# EAGLE design HV Board rev13 (EAGLE 9.6.2)
ENGINEER: Arvind Srinivasan

## Sheet 1 of 3: GLV Systems 1 (Main I/O, Power, Current Sensors, and Shutdown Circuit)
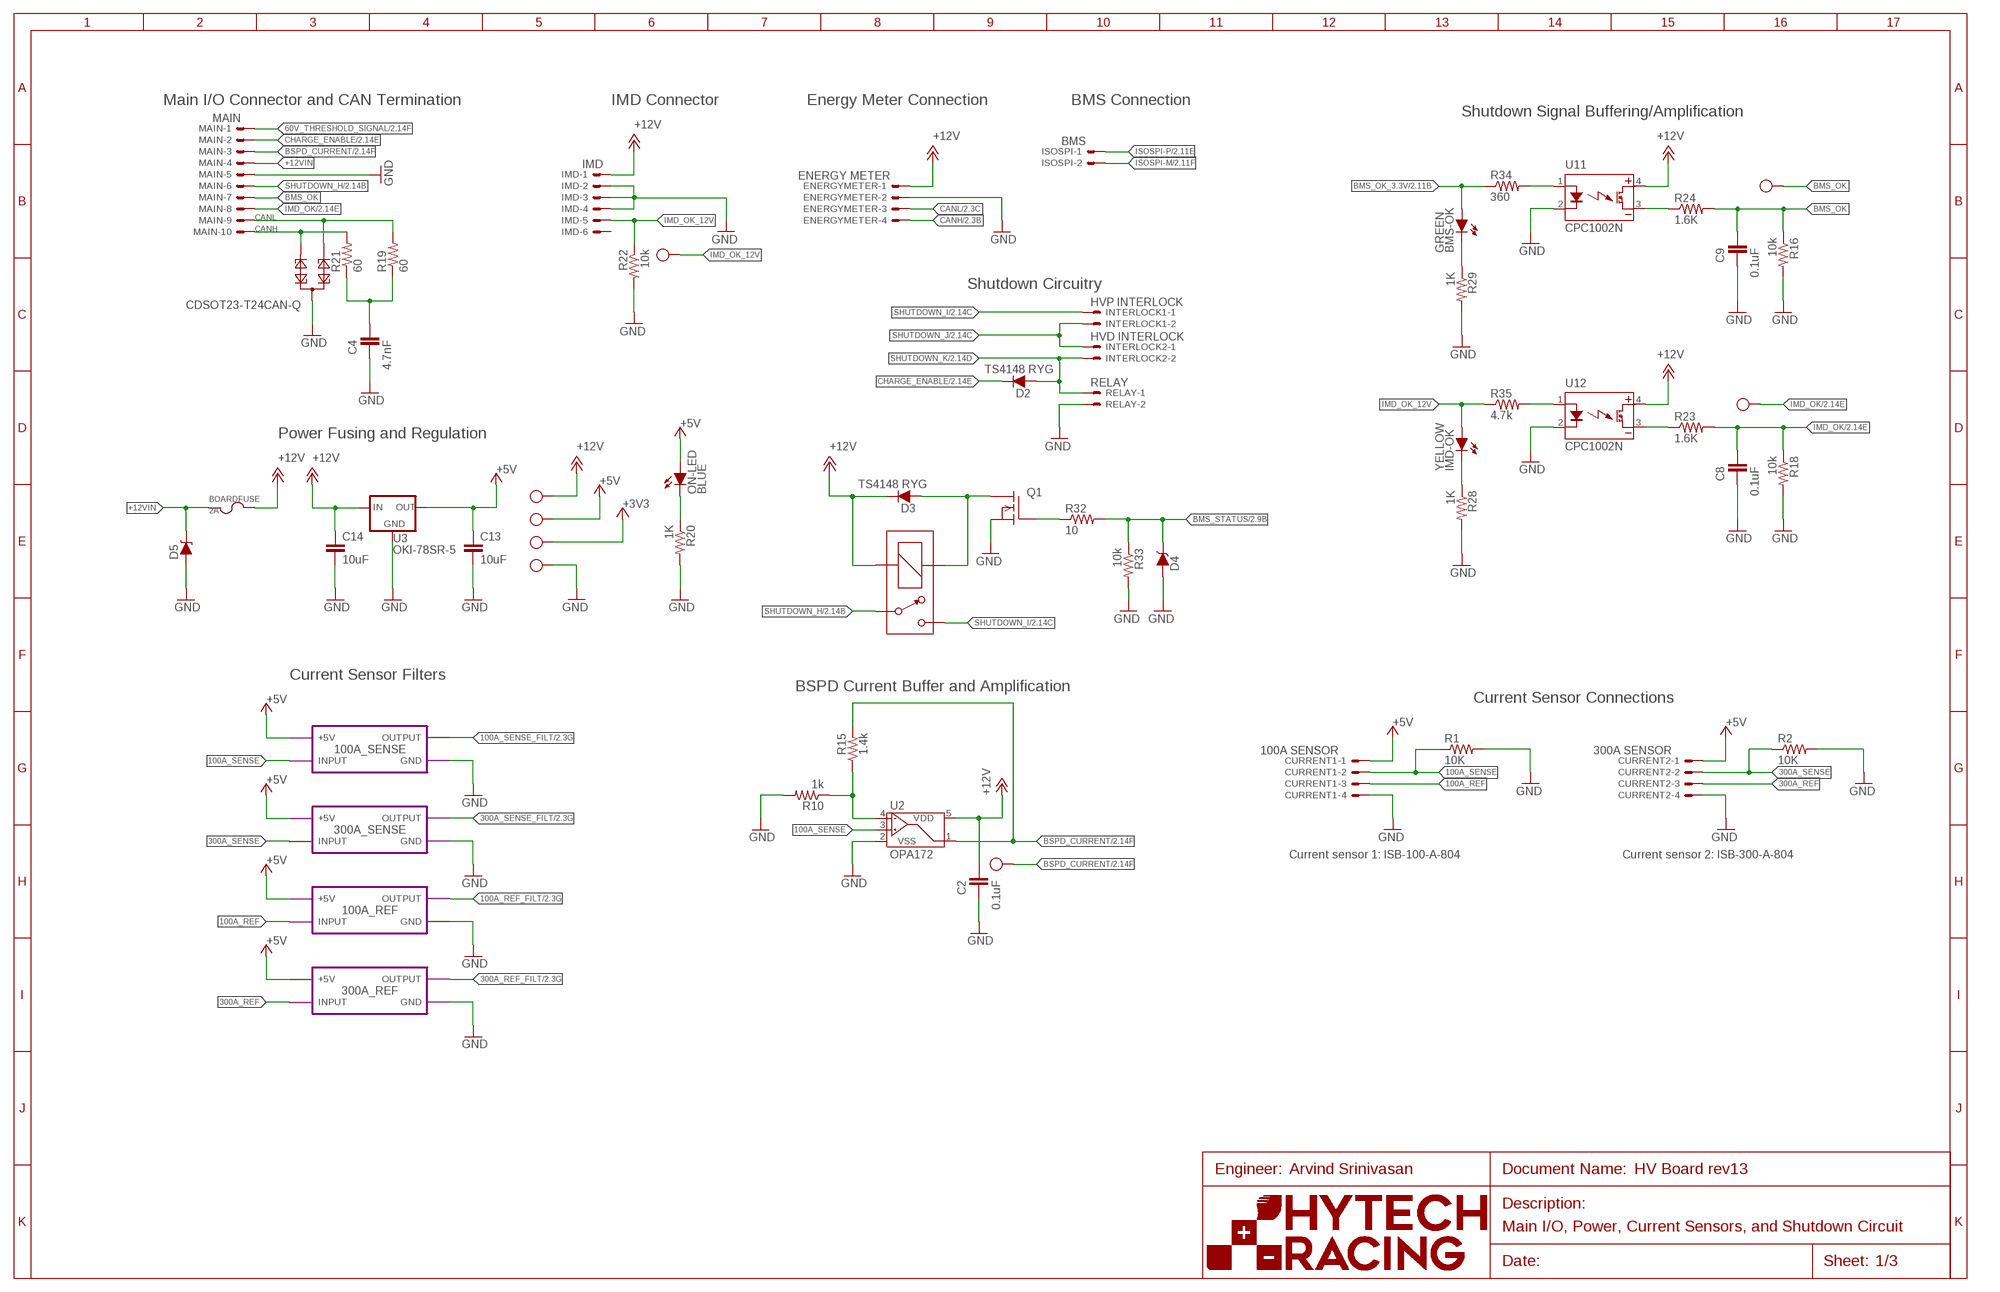
[diagram p0: schematic, sheet 1]
U$1 (FRAME_B): FRAME_DESCRIPTION: Main I/O, Power, Current Sensors, and Shutdown Circuit; ORIENTATION: LANDSCAPE; SIZE: B

### Parts
BMS-OK  GREEN  LED-0603  [LED-603]
BOARDFUSE  2A  FUSE_MINIBLADE  [MINI-BLADE_FUSE_HOLDER]
C2  0.1uF  CAP0603-CAP  [0603-CAP]
C4  4.7nF  CAP0603-CAP  [0603-CAP]
C8  0.1uF  CAP0603-CAP  [0603-CAP]
C9  0.1uF  CAP0603-CAP  [0603-CAP]
C13  10uF  CAP0603-CAP  [0603-CAP]
C14  10uF  CAP0603-CAP  [0603-CAP]
CURRENT1  100A SENSOR  CONNECTOR-4NANO-FIT-VERTICAL-4  [NANO-FIT_VERTICAL-4]
CURRENT2  300A SENSOR  CONNECTOR-4NANO-FIT-VERTICAL-4  [NANO-FIT_VERTICAL-4]
D2  TS4148 RYG  DIODE0805  [0805_D]
D3  TS4148 RYG  DIODE0805  [0805_D]
D4  MMBZ5246BLT1G  DIODE_ZENER  [SOT23]
D5  TVS_DIODE  [U-DFN1608-2]
ENERGYMETER  ENERGY METER  CONNECTOR-4NANO-FIT-VERTICAL-4  [NANO-FIT_VERTICAL-4]
IMD  IMD  CONNECTOR-6NANO-FIT_VERTICAL-6  [NANO-FIT_VERTICAL-6]
IMD-OK  YELLOW  LED-0603  [LED-603]
INTERLOCK1  HVP INTERLOCK  CONNECTOR-2NANO-FIT_VERTICAL-2  [NANO-FIT_VERTICAL-2]
INTERLOCK2  HVD INTERLOCK  CONNECTOR-2NANO-FIT_VERTICAL-2  [NANO-FIT_VERTICAL-2]
ISOSPI  BMS  CONNECTOR-2NANO-FIT_VERTICAL-2  [NANO-FIT_VERTICAL-2]
MAIN  MAIN  CONNECTOR-10NANO-FIT_VERTICAL-10  [NANO-FIT_VERTICAL-10]
ON-LED  BLUE  LED-0603  [LED-603]
Q1  DMG3406L  DMG3406LSOT  [SOT23]
R1  10K  RESISTOR0603  [0603-RES]
R2  10K  RESISTOR0603  [0603-RES]
R10  1k  RESISTOR0603  [0603-RES]
R15  1.4k  RESISTOR0603  [0603-RES]
R16  10k  RESISTOR0603  [0603-RES]
R18  10k  RESISTOR0603  [0603-RES]
R19  60  RESISTOR0603  [0603-RES]
R20  1K  RESISTOR0603  [0603-RES]
R21  60  RESISTOR0603  [0603-RES]
R22  10k  RESISTOR0603  [0603-RES]
R23  1.6K  RESISTOR0603  [0603-RES]
R24  1.6K  RESISTOR0603  [0603-RES]
R28  1K  RESISTOR0603  [0603-RES]
R29  1K  RESISTOR0603  [0603-RES]
R32  10  RESISTOR0603  [0603-RES]
R33  10k  RESISTOR0603  [0603-RES]
R34  360  RESISTOR0603  [0603-RES]
R35  4.7k  RESISTOR0603  [0603-RES]
RELAY  RELAY  CONNECTOR-2NANO-FIT_VERTICAL-2  [NANO-FIT_VERTICAL-2]
SOFTWARE_SHUTDOWN  SOFTWARE SHUTDOWN  G5LE-1A4  [G5LE-1A4]
U2  OPA172  OPA172SOT-323-5  [SOT323-5]
U3  OKI-78SR-5  [OKI-78SR]
U8  CDSOT23-T24CAN-Q  [SOT23]
U11  CPC1002N  [SOP04]
U12  CPC1002N  [SOP04]
U$3  TEST_POINTMICRO_MINIATURE  [MICRO_MINIATURE]
U$4  TEST_POINTMICRO_MINIATURE  [MICRO_MINIATURE]
U$5  TEST_POINTMICRO_MINIATURE  [MICRO_MINIATURE]
U$6  TEST_POINTMICRO_MINIATURE  [MICRO_MINIATURE]
U$7  TEST_POINTMICRO_MINIATURE  [MICRO_MINIATURE]
U$11  TEST_POINTMICRO_MINIATURE  [MICRO_MINIATURE]
U$13  TEST_POINTMICRO_MINIATURE  [MICRO_MINIATURE]
U$14  TEST_POINTMICRO_MINIATURE  [MICRO_MINIATURE]

### Module instances
100A_SENSE = 1KHZ-FILTER
300A_SENSE = 1KHZ-FILTER
100A_REF = 1KHZ-FILTER
300A_REF = 1KHZ-FILTER

### Nets
60V_THRESHOLD_SIGNAL: MAIN.P$1 ; also sheet 2,3
100A_REF: CURRENT1.P$3 ; port 100A_REF.INPUT
100A_REF_FILT: port 100A_REF.OUTPUT ; also sheet 2
100A_SENSE: CURRENT1.P$2 R1.1 U2.3(VIN+) ; port 100A_SENSE.INPUT
100A_SENSE_FILT: port 100A_SENSE.OUTPUT ; also sheet 2
300A_REF: CURRENT2.P$3 ; port 300A_REF.INPUT
300A_REF_FILT: port 300A_REF.OUTPUT ; also sheet 2
300A_SENSE: CURRENT2.P$2 R2.1 ; port 300A_SENSE.INPUT
300A_SENSE_FILT: port 300A_SENSE.OUTPUT ; also sheet 2
+3V3: U$7.P$1 ; also sheet 2
+5V: C13.1 CURRENT1.P$1 CURRENT2.P$1 ON-LED.A U3.3(OUT) U$4.P$1 ; port 100A_SENSE.+5V 300A_SENSE.+5V 100A_REF.+5V 300A_REF.+5V ; also sheet 2,3
+12V: BOARDFUSE.R1 BOARDFUSE.R2 C2.2 C14.1 D3.C ENERGYMETER.P$1 IMD.P$1 SOFTWARE_SHUTDOWN.2(COIL-) U2.5(VDD) U3.1(IN) U11.4(DC+) U12.4(DC+) U$5.P$1
+12VIN: BOARDFUSE.L1 BOARDFUSE.L2 D5.P$2(C) MAIN.P$4
BMS_OK: C9.2 MAIN.P$7 R16.1 R24.2 U$14.P$1
BMS_OK_3.3V: BMS-OK.A R34.1 ; also sheet 2
BMS_OK_PRE_FILTER: R24.1 U11.3(DC-)
BMS_STATUS: D4.3(C) R32.2 R33.1 ; also sheet 2
BSPD_CURRENT: MAIN.P$3 R15.2 U2.1(VOUT) U$6.P$1 ; also sheet 2
CANH: ENERGYMETER.P$4 MAIN.P$10 R21.2 U8.2 ; also sheet 2
CANL: ENERGYMETER.P$3 MAIN.P$9 R19.2 U8.1 ; also sheet 2
CHARGE_ENABLE: D2.C MAIN.P$2 ; also sheet 2
GND: C2.1 C4.1 C8.1 C9.1 C13.2 C14.2 CURRENT1.P$4 CURRENT2.P$4 D4.1(A) D5.P$1(A) ENERGYMETER.P$2 IMD.P$2 IMD.P$3 IMD.P$4 MAIN.P$5 Q1.2(S) R1.2 R2.2 R10.2 R16.2 R18.2 R20.2 R22.2 R28.2 R29.2 R33.2 RELAY.P$2 U2.2(VSS) U3.2(GND) U8.3 U11.2(CONTROL-) U12.2(CONTROL-) U$3.P$1 ; port 100A_SENSE.GND 300A_SENSE.GND 100A_REF.GND 300A_REF.GND ; also sheet 2,3
IMD_OK: C8.2 MAIN.P$8 R18.1 R23.2 U$13.P$1 ; also sheet 2
IMD_OK_12V: IMD-OK.A IMD.P$5 R22.1 R35.1 U$11.P$1
IMD_OK_PRE_FILTER: R23.1 U12.3(DC-)
ISOSPI-M [ISO_SPI]: ISOSPI.P$2 ; also sheet 2
ISOSPI-P [ISO_SPI]: ISOSPI.P$1 ; also sheet 2
N$1: D3.A Q1.3(D) SOFTWARE_SHUTDOWN.1(COIL+)
N$3: ON-LED.C R20.1
N$7: R10.1 R15.1 U2.4(VIN-)
N$8: R35.2 U12.1(CONTROL+)
N$9: IMD-OK.C R28.1
N$11: C4.2 R19.1 R21.1
N$12: Q1.1(G) R32.1
N$16: R34.2 U11.1(CONTROL+)
N$17: BMS-OK.C R29.1
SHUTDOWN_H: MAIN.P$6 SOFTWARE_SHUTDOWN.P ; also sheet 2
SHUTDOWN_I: INTERLOCK1.P$1 SOFTWARE_SHUTDOWN.S ; also sheet 2
SHUTDOWN_J: INTERLOCK1.P$2 INTERLOCK2.P$1 ; also sheet 2
SHUTDOWN_K: D2.A INTERLOCK2.P$2 RELAY.P$1 ; also sheet 2,3
Unconnected: IMD.P$6

### Notes on the sheet
- Main I/O Connector and CAN Termination | IMD Connector | Energy Meter Connection | BMS Connection
- Shutdown Signal Buffering/Amplification
- Shutdown Circuitry
- Power Fusing and Regulation
- Current Sensor Filters
- BSPD Current Buffer and Amplification
- Current Sensor Connections
- Current sensor 1: ISB-100-A-804 | Current sensor 2: ISB-300-A-804

## Sheet 2 of 3: GLV Systems 2 (Microcontroller, Watchdog, BMS, CAN, and ADC)
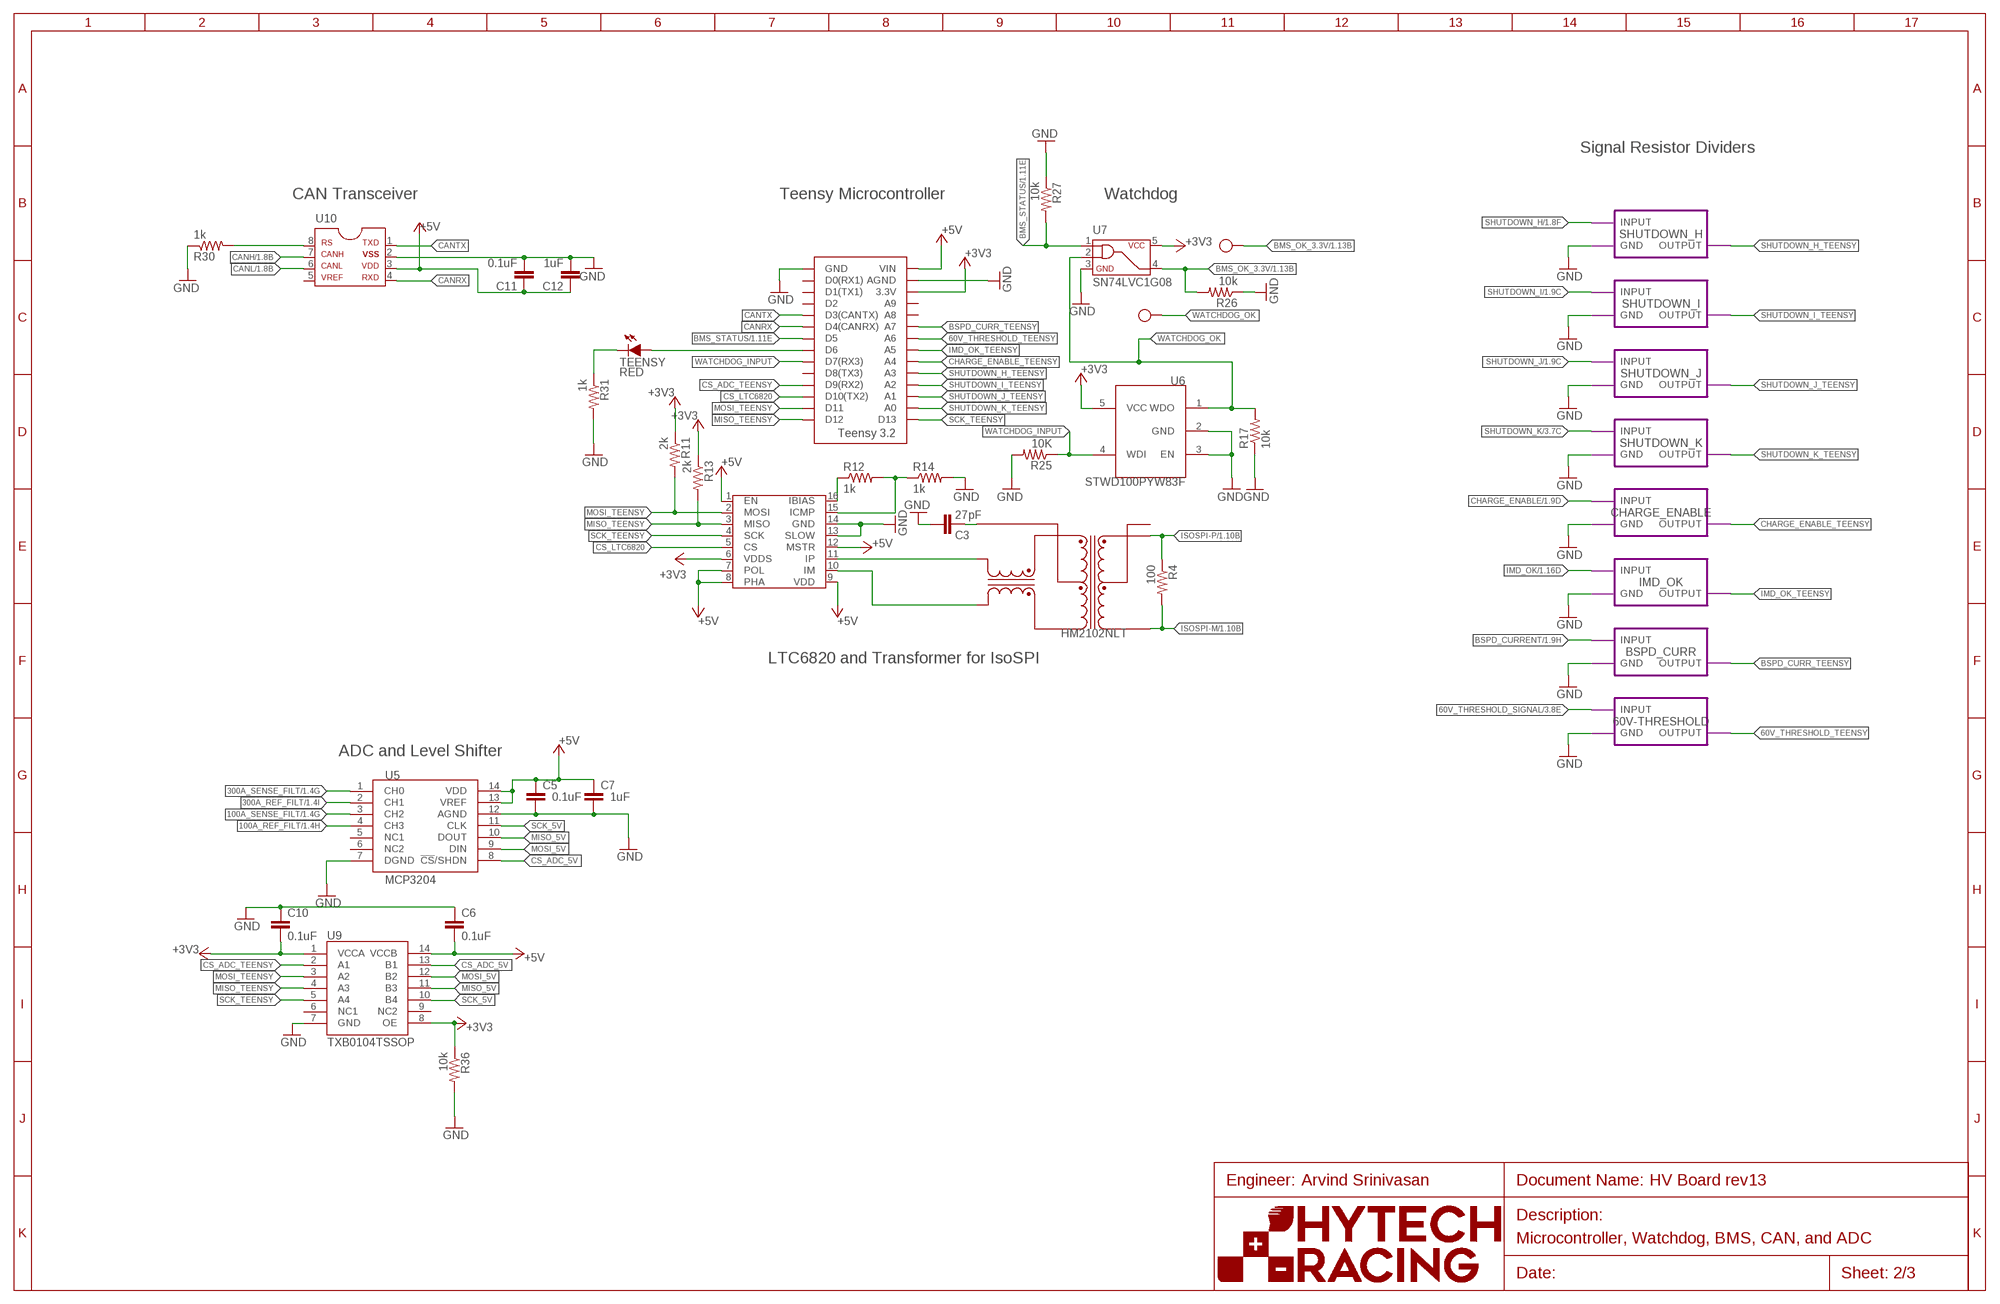
[diagram p1: schematic, sheet 2]
U$12 (FRAME_B): FRAME_DESCRIPTION: Microcontroller, Watchdog, BMS, CAN, and ADC; ORIENTATION: LANDSCAPE; SIZE: B

### Parts
C3  27pF  CAP0603-CAP  [0603-CAP]
C5  0.1uF  CAP0603-CAP  [0603-CAP]
C6  0.1uF  CAP0603-CAP  [0603-CAP]
C7  1uF  CAP0603-CAP  [0603-CAP]
C10  0.1uF  CAP0603-CAP  [0603-CAP]
C11  0.1uF  CAP0603-CAP  [0603-CAP]
C12  1uF  CAP0603-CAP  [0603-CAP]
R4  100  RESISTOR0603  [0603-RES]
R11  2k  RESISTOR0603  [0603-RES]
R12  1k  RESISTOR0603  [0603-RES]
R13  2k  RESISTOR0603  [0603-RES]
R14  1k  RESISTOR0603  [0603-RES]
R17  10k  RESISTOR0603  [0603-RES]
R25  10K  RESISTOR0603  [0603-RES]
R26  10k  RESISTOR0603  [0603-RES]
R27  10k  RESISTOR0603  [0603-RES]
R30  1k  RESISTOR0603  [0603-RES]
R31  1k  RESISTOR0603  [0603-RES]
R36  10k  RESISTOR0603  [0603-RES]
TEENSY  RED  LED-0603  [LED-603]
TEENSY3.1  TEENSY_3.2_SIMPLE  [TEENSY_3.2_SIMPLE]
U1  HM2102NLT  [HM2102NLT]
U4  LTC6820  [MSOP-16]
U5  MCP3204  [SO14]
U6  STWD100PYW83F  [SOT323-5]
U7  SN74LVC1G08  SN74LVC1G08SOT-323-5  [SOT323-5]
U9  TXB0104TSSOP  [TSSOP-14]
U10  MCP2551  [SOIC-08]
U$9  TEST_POINTMICRO_MINIATURE  [MICRO_MINIATURE]
U$10  TEST_POINTMICRO_MINIATURE  [MICRO_MINIATURE]

### Module instances
SHUTDOWN_K = 43/12-RESISTOR-DIVIDER
SHUTDOWN_I = 43/12-RESISTOR-DIVIDER
SHUTDOWN_H = 43/12-RESISTOR-DIVIDER
IMD_OK = 43/12-RESISTOR-DIVIDER
BSPD_CURR = 43/12-RESISTOR-DIVIDER
CHARGE_ENABLE = 43/12-RESISTOR-DIVIDER
60V-THRESHOLD = 10/10-RESISTOR-DIVIDER
SHUTDOWN_J = 43/12-RESISTOR-DIVIDER

### Nets
60V_THRESHOLD_SIGNAL: port 60V-THRESHOLD.INPUT ; also sheet 1,3
60V_THRESHOLD_TEENSY: TEENSY3.1.A6 ; port 60V-THRESHOLD.OUTPUT
100A_REF_FILT: U5.4(CH3) ; also sheet 1
100A_SENSE_FILT: U5.3(CH2) ; also sheet 1
300A_REF_FILT: U5.2(CH1) ; also sheet 1
300A_SENSE_FILT: U5.1(CH0) ; also sheet 1
+3V3: C10.1 R11.1 R13.1 R36.1 TEENSY3.1.3.3V U4.6(VDDS) U6.5(VCC) U7.5 U9.1(VCCA) U9.8(OE) ; also sheet 1
+5V: C5.1 C6.1 C7.1 C11.2 C12.2 TEENSY3.1.VIN U4.1(EN) U4.7(POL) U4.8(PHA) U4.9(VDD) U4.12(MSTR) U5.13(VREF) U5.14(VDD) U9.14(VCCB) U10.3 ; also sheet 1,3
BMS_OK_3.3V: R26.2 U7.4 U$10.P$1 ; also sheet 1
BMS_STATUS: R27.2 TEENSY3.1.D5 U7.1 ; also sheet 1
BSPD_CURR_TEENSY: TEENSY3.1.A7 ; port BSPD_CURR.OUTPUT
BSPD_CURRENT: port BSPD_CURR.INPUT ; also sheet 1
CANH: U10.7 ; also sheet 1
CANL: U10.6 ; also sheet 1
CANRX: TEENSY3.1.D4(CANRX) U10.4
CANTX: TEENSY3.1.D3(CANTX) U10.1
CHARGE_ENABLE: port CHARGE_ENABLE.INPUT ; also sheet 1
CHARGE_ENABLE_TEENSY: TEENSY3.1.A4 ; port CHARGE_ENABLE.OUTPUT
CS_ADC_5V: U5.8(!CS!/SHDN) U9.13(B1)
CS_ADC_TEENSY: TEENSY3.1.D9(RX2) U9.2(A1)
CS_LTC6820: TEENSY3.1.D10(TX2) U4.5(CS)
GND: C3.2 C5.2 C6.2 C7.2 C10.2 C11.1 C12.1 R14.2 R17.1 R25.2 R26.1 R27.1 R30.1 R31.2 R36.2 TEENSY3.1.AGND TEENSY3.1.GND U4.13(SLOW) U4.14(GND) U5.7(DGND) U5.12(AGND) U6.2(GND) U6.3(EN) U7.3 U9.7(GND) U10.2 ; port SHUTDOWN_H.GND SHUTDOWN_I.GND SHUTDOWN_K.GND CHARGE_ENABLE.GND IMD_OK.GND BSPD_CURR.GND 60V-THRESHOLD.GND SHUTDOWN_J.GND ; also sheet 1,3
IM: U1.P$10(TD-) U4.10(IM)
IMD_OK: port IMD_OK.INPUT ; also sheet 1
IMD_OK_TEENSY: TEENSY3.1.A5 ; port IMD_OK.OUTPUT
IP: U1.P$12(TD+) U4.11(IP)
ISOSPI-M [ISO_SPI]: R4.2 U1.P$3(MX-) ; also sheet 1
ISOSPI-P [ISO_SPI]: R4.1 U1.P$1(MX+) ; also sheet 1
MISO_5V: U5.10(DOUT) U9.11(B3)
MISO_TEENSY: R13.2 TEENSY3.1.D12 U4.3(MISO) U9.4(A3)
MOSI_5V: U5.9(DIN) U9.12(B2)
MOSI_TEENSY: R11.2 TEENSY3.1.D11 U4.2(MOSI) U9.3(A2)
N$26: R30.2 U10.8
N$29: R31.1 TEENSY.C
N$31: R12.1 U4.16(IBIAS)
N$32: R12.2 R14.1 U4.15(ICMP)
N$35: C3.1 U1.P$11(TCT)
SCK_5V: U5.11(CLK) U9.10(B4)
SCK_TEENSY: TEENSY3.1.D13 U4.4(SCK) U9.5(A4)
SHUTDOWN_H: port SHUTDOWN_H.INPUT ; also sheet 1
SHUTDOWN_H_TEENSY: TEENSY3.1.A3 ; port SHUTDOWN_H.OUTPUT
SHUTDOWN_I: port SHUTDOWN_I.INPUT ; also sheet 1
SHUTDOWN_I_TEENSY: TEENSY3.1.A2 ; port SHUTDOWN_I.OUTPUT
SHUTDOWN_J: port SHUTDOWN_J.INPUT ; also sheet 1
SHUTDOWN_J_TEENSY: TEENSY3.1.A1 ; port SHUTDOWN_J.OUTPUT
SHUTDOWN_K: port SHUTDOWN_K.INPUT ; also sheet 1,3
SHUTDOWN_K_TEENSY: TEENSY3.1.A0 ; port SHUTDOWN_K.OUTPUT
TEENSY_STATUS: TEENSY3.1.D6 TEENSY.A
WATCHDOG_INPUT: R25.1 TEENSY3.1.D7(RX3) U6.4(WDI)
WATCHDOG_OK: R17.2 U6.1(WDO) U7.2 U$9.P$1
Unconnected: TEENSY3.1.A8 TEENSY3.1.A9 TEENSY3.1.D0(RX1) TEENSY3.1.D1(TX1) TEENSY3.1.D2 TEENSY3.1.D8(TX3) U1.P$2(MCT) U1.P$4(MX+) U1.P$5(MCT) U1.P$6(MX-) U1.P$7(TD-) U1.P$8(TCT) U1.P$9(TD+) U5.5(NC1) U5.6(NC2) U9.6(NC1) U9.9(NC2) U10.5

### Notes on the sheet
- Signal Resistor Dividers
- CAN Transceiver | Teensy Microcontroller | Watchdog
- LTC6820 and Transformer for IsoSPI
- ADC and Level Shifter

## Sheet 3 of 3: HV Systems (Discharge, Precharge, and TSAL Signal/Voltage Indicator)
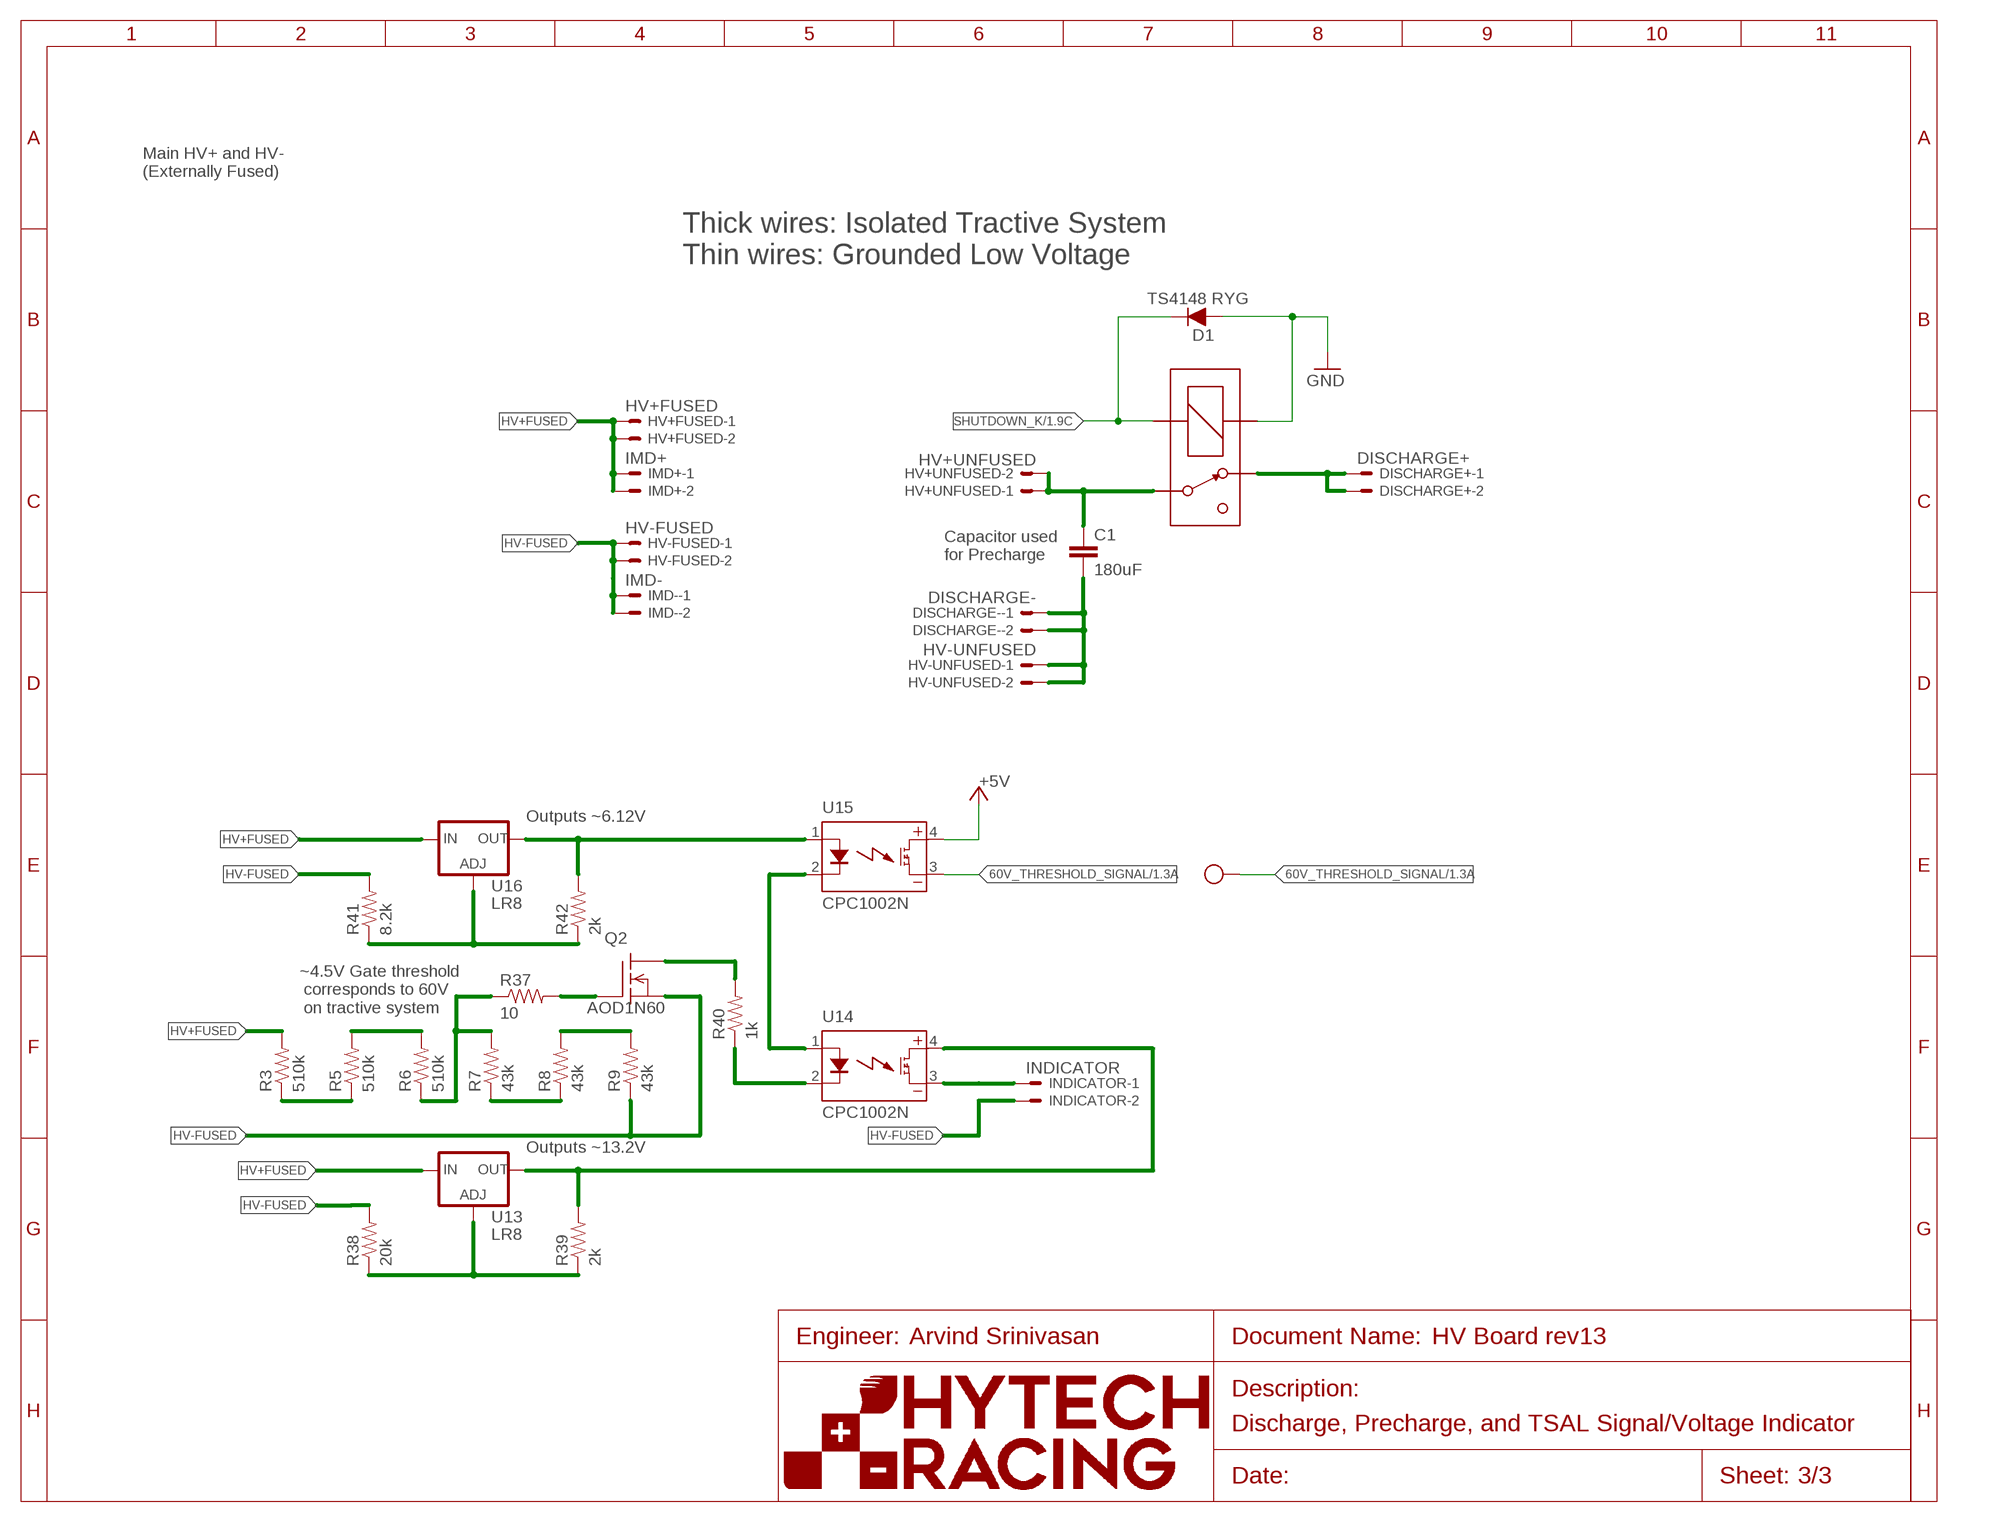
[diagram p2: schematic, sheet 3]
U$2 (FRAME_A): FRAME_DESCRIPTION: Discharge, Precharge, and TSAL Signal/Voltage Indicator; ORIENTATION: LANDSCAPE; SIZE: A

### Parts
$$U$12  DBT71210  [DBT71210]
C1  180uF  CAP  [LLS2V181MELA]
D1  TS4148 RYG  DIODE0805  [0805_D]
DISCHARGE+  DISCHARGE+  CONNECTOR-2NANO-FIT_VERTICAL-2  [NANO-FIT_VERTICAL-2]
DISCHARGE-  DISCHARGE-  CONNECTOR-2NANO-FIT_VERTICAL-2  [NANO-FIT_VERTICAL-2]
HV+FUSED  HV+FUSED  CONNECTOR-2NANO-FIT_VERTICAL-2  [NANO-FIT_VERTICAL-2]
HV+UNFUSED  HV+UNFUSED  CONNECTOR-2NANO-FIT_VERTICAL-2  [NANO-FIT_VERTICAL-2]
HV-FUSED  HV-FUSED  CONNECTOR-2NANO-FIT_VERTICAL-2  [NANO-FIT_VERTICAL-2]
HV-UNFUSED  HV-UNFUSED  CONNECTOR-2NANO-FIT_VERTICAL-2  [NANO-FIT_VERTICAL-2]
IMD+  IMD+  CONNECTOR-2NANO-FIT_VERTICAL-2  [NANO-FIT_VERTICAL-2]
IMD-  IMD-  CONNECTOR-2NANO-FIT_VERTICAL-2  [NANO-FIT_VERTICAL-2]
INDICATOR  INDICATOR  CONNECTOR-2NANO-FIT_VERTICAL-2  [NANO-FIT_VERTICAL-2]
Q2  AOD1N60  N-CHANNEL_MOSFETAOD1N60  [TO-252]
R3  510k  RESISTOR0603  [0603-RES]
R5  510k  RESISTOR0603  [0603-RES]
R6  510k  RESISTOR0603  [0603-RES]
R7  43k  RESISTOR0603  [0603-RES]
R8  43k  RESISTOR0603  [0603-RES]
R9  43k  RESISTOR0603  [0603-RES]
R37  10  RESISTOR0603  [0603-RES]
R38  20k  RESISTOR0603  [0603-RES]
R39  2k  RESISTOR0603  [0603-RES]
R40  1k  RESISTOR0603  [0603-RES]
R41  8.2k  RESISTOR0603  [0603-RES]
R42  2k  RESISTOR0603  [0603-RES]
U13  LR8  [SOT89]
U14  CPC1002N  [SOP04]
U15  CPC1002N  [SOP04]
U16  LR8  [SOT89]
U$8  TEST_POINTMICRO_MINIATURE  [MICRO_MINIATURE]

### Nets
60V_THRESHOLD_SIGNAL: U15.3(DC-) U$8.P$1 ; also sheet 1,2
+5V: U15.4(DC+) ; also sheet 1,2
DISCHARGE+ [TS]: $$U$12.CONTACT2(O) DISCHARGE+.P$1 DISCHARGE+.P$2
GND: $$U$12.COIL+ D1.A ; also sheet 1,2
HV+FUSED [TS]: HV+FUSED.P$1 HV+FUSED.P$2 IMD+.P$1 IMD+.P$2 R3.2 U13.1(IN) U16.1(IN)
HV+UNFUSED [TS]: $$U$12.CONTACT1(P) C1.P$1 HV+UNFUSED.P$1 HV+UNFUSED.P$2
HV-FUSED [TS]: HV-FUSED.P$1 HV-FUSED.P$2 IMD-.P$1 IMD-.P$2 INDICATOR.P$2 Q2.3(S) R9.1 R38.2 R41.2
HV-UNFUSED: C1.P$2 DISCHARGE-.P$1 DISCHARGE-.P$2 HV-UNFUSED.P$1 HV-UNFUSED.P$2
N$4: Q2.1(G) R37.2
N$5 [TS]: R39.2 U13.2(OUT) U13.PAD(OUT) U14.4(DC+)
N$6 [TS]: R38.1 R39.1 U13.3(ADJ)
N$18 [TS]: R42.2 U15.1(CONTROL+) U16.2(OUT) U16.PAD(OUT)
N$19 [TS]: R3.1 R5.1
N$24 [TS]: R5.2 R6.2
N$27 [TS]: R7.1 R8.1
N$28 [TS]: R8.2 R9.2
N$30 [TS]: R40.1 U14.2(CONTROL-)
N$33 [TS]: U14.1(CONTROL+) U15.2(CONTROL-)
N$34 [TS]: INDICATOR.P$1 U14.3(DC-)
N$41 [TS]: R41.1 R42.1 U16.3(ADJ)
N$55 [TS]: R6.1 R7.2 R37.1
N$58 [TS]: Q2.2(TAB)(D) R40.2
SHUTDOWN_K: $$U$12.COIL- D1.C ; also sheet 1,2

### Notes on the sheet
- Main HV+ and HV-
  (Externally Fused)
- Thick wires: Isolated Tractive System
  Thin wires: Grounded Low Voltage
- Capacitor used
  for Precharge
- Outputs ~6.12V
- ~4.5V Gate threshold
   corresponds to 60V
   on tractive system
- Outputs ~13.2V

## Library data of the parts
$$U$12 = HyTechDevices:DBT71210: DBT71210 Reed Relay Form B (Standard normally closed), switch 12V
BMS-OK IMD-OK ON-LED TEENSY = HyTechDevices:LED: Light Emitting Diode (LED) Source: Dangerous Prototypes Eagle Library <https://github.com/DangerousPrototypes/Eagle_Part_Library>
BOARDFUSE = HyTechDevices:FUSE: Fuse/Fuseclips Keystone Electronics 3568 Fuse Mouser Part <http://www.mouser.com/ProductDetail/Keystone-Electronics/3568> Datasheet <http://www.mouser.com/ds/2/215/568-742601.pdf> Bussman/Eaton Midget Fuse Clip 1A3400 <http://www.mouser.com/ProductDetail/Bussmann-Eaton/BK-1A3400-09-R/?qs=sGAEpiMZZMuG%252bgnN5hGYGzzlAelq2OxnKqVSMVjq8I4%3d> Schurter 0751.0110 Brass Fuse Clip Datasheet <http://www.mouser.com/ds/2/358/typ_OG__Clip__5x20-2553.pdf> Bel Fuse 0ZCF Series Surface Mount PTC (resettable) Fuse Datasheet <https://belfuse.com/resources/CircuitProtection/datasheets/0ZCF%20Nov2016.pdf> Littelfuse 1812L Series Surface Mount PTC (resettable) Fuse Datasheet <https://m.littelfuse.com/~/media/electronics/datasheets/resettable_ptcs/littelfuse_ptc_1812l_datasheet.pdf.pdf>; RATING: 3A
C1 = HyTechDevices:CAP: Capacitor Standard 0603 ceramic capacitor, and 0.1" leaded capacitor.
C2 C4 C8 C9 = HyTechDevices:CAP: Capacitor Standard 0603 ceramic capacitor, and 0.1" leaded capacitor.; TOLERANCE: 5%; VOLTAGE: 50V
C3 C5-C7 C10-C12 = HyTechDevices:CAP: Capacitor Standard 0603 ceramic capacitor, and 0.1" leaded capacitor.; TOLERANCE: 5%; VOLTAGE: 10V
C13 C14 = HyTechDevices:CAP: Capacitor Standard 0603 ceramic capacitor, and 0.1" leaded capacitor.; TOLERANCE: 5%; VOLTAGE: 25V
CURRENT1 CURRENT2 ENERGYMETER = HyTechDevices:CONNECTOR-4: Mini-Fit Junior connector 4 pole Source: http://www.molex.com
D1-D3 = HyTechDevices:DIODE: DIODE general purpose rectifier
D4 = HyTechDevices:DIODE_ZENER: ZENER DIODE
D5 = HyTechDevices:TVS_DIODE
DISCHARGE+ DISCHARGE- HV+FUSED HV+UNFUSED HV-FUSED HV-UNFUSED IMD+ IMD- INDICATOR INTERLOCK1 INTERLOCK2 ISOSPI RELAY = HyTechDevices:CONNECTOR-2: Mini-Fit Junior connector 2 pole Source: http://www.molex.com
IMD = HyTechDevices:CONNECTOR-6: Mini-Fit Junior connector 6 pole Source: http://www.molex.com
MAIN = HyTechDevices:CONNECTOR-10: Mini-Fit Junior connector 10 pole Source: http://www.molex.com
Q1 = HyTechDevices:DMG3406L: Generic NPN MOSFET DMG3406L (SOT-23, 2.8 A 30V)
Q2 = HyTechDevices:N-CHANNEL_MOSFET: Generic N-Channel MOSFET
R1 R2 R10-R16 R18-R25 R28-R31 R34-R36 = HyTechDevices:RESISTOR: Resistor Basic schematic elements and footprints for 0603, 1206, and PTH resistors.; TOLERANCE: 1%
R3 R5-R9 R17 R26 R27 R32 R33 R37-R42 = HyTechDevices:RESISTOR: Resistor Basic schematic elements and footprints for 0603, 1206, and PTH resistors.
R4 = HyTechDevices:RESISTOR: Resistor Basic schematic elements and footprints for 0603, 1206, and PTH resistors.; TOLERANCE: 1%; TYPE: TERMINATION
SOFTWARE_SHUTDOWN = HyTechDevices:G5LE-1A4: Omron G5LE SPST Relay DC12 (12VDC) model used Coil voltage: 75% - 170% of nominal voltage Datasheet <https://www.omron.com/ecb/products/pdf/en-g5le.pdf>
TEENSY3.1 = HyTechDevices:TEENSY_3.2_SIMPLE: Simple version of the Teensy 3.2 board that only uses the 2 main rows of pins, not the inner pins or the pins opposite the usb port.
U1 = HyTechDevices:HM2102NLT: 2 Channel SMT Transformer Turns ratio: 1CT: 1CT Isolation Voltage: 4300 VDC Inductance: 150 uH Leakage Inductance: 0.50 uH max DataSheet <https://www.mouser.com/datasheet/2/336/HM2102NL-1218600.pdf>
U2 = HyTechDevices:OPA172: TI OPA172 36V Op-Amp Datasheet <https://www.ti.com/lit/ds/symlink/opa172.pdf>
U3 = HyTechDevices:OKI-78SR-5: Murata OKI-78SR 5V 1.5A Non-Isolated Switching Regulator DC/DC - Datasheet <https://power.murata.com/data/power/oki-78sr.pdf>
U4 = HyTechDevices:LTC6820: Linear Technology isoSPI Isolated Communications Interface Datasheet <http://cds.linear.com/docs/en/datasheet/6820fb.pdf>
U5 = HyTechDevices:MCP3204
U6 = HyTechDevices:STWD100PYW83F: STWD100 Watchdog Timer (push-pull configuration) Datasheet <https://www.st.com/resource/en/datasheet/stwd100.pdf>
U7 = HyTechDevices:SN74LVC1G08: TI SN74LVC1G08 SINGLE 2-INPUT POSITIVE-AND GATE Datasheet <https://www.ti.com/lit/ds/symlink/sn74lvc1g08.pdf>
U8 = HyTechDevices:CDSOT23-T24CAN-Q: CAN Bus dual TVS array for transceiver ESD and surge protection
U9 = HyTechDevices:TXB0104: Texas Instruments TXB0104 4-channel low voltage to high voltage Logic Level Shifter. Minimum input voltage level 1.8V. Maximum output voltage level 5.5V.
U10 = HyTechDevices:MCP2551: MCP2551 High-Speed CAN Transceiver Product Webpage <https://www.microchip.com/wwwproducts/en/MCP2551> Datasheet <http://ww1.microchip.com/downloads/en/DeviceDoc/21667f.pdf> This device is outdated It is replaced by MCP2561. Comparison Page <https://www.microchip.com/wwwproducts/ProductCompare/MCP2551/MCP2561> Product Webpage <https://www.microchip.com/wwwproducts/en/MCP2561> Datasheet <http://ww1.microchip.com/downloads/en/DeviceDoc/20005167C.pdf>
U11 U12 U14 U15 = HyTechDevices:CPC1002N: IXYS Solid State Relay .7A
U13 U16 = HyTechDevices:LR8
U$3-U$11 U$13 U$14 = HyTechDevices:TEST_POINT: Keystone Electronics Test Point 5005

## Module 43/12-RESISTOR-DIVIDER
Ports: INPUT(in) GND(pwr) OUTPUT(out)
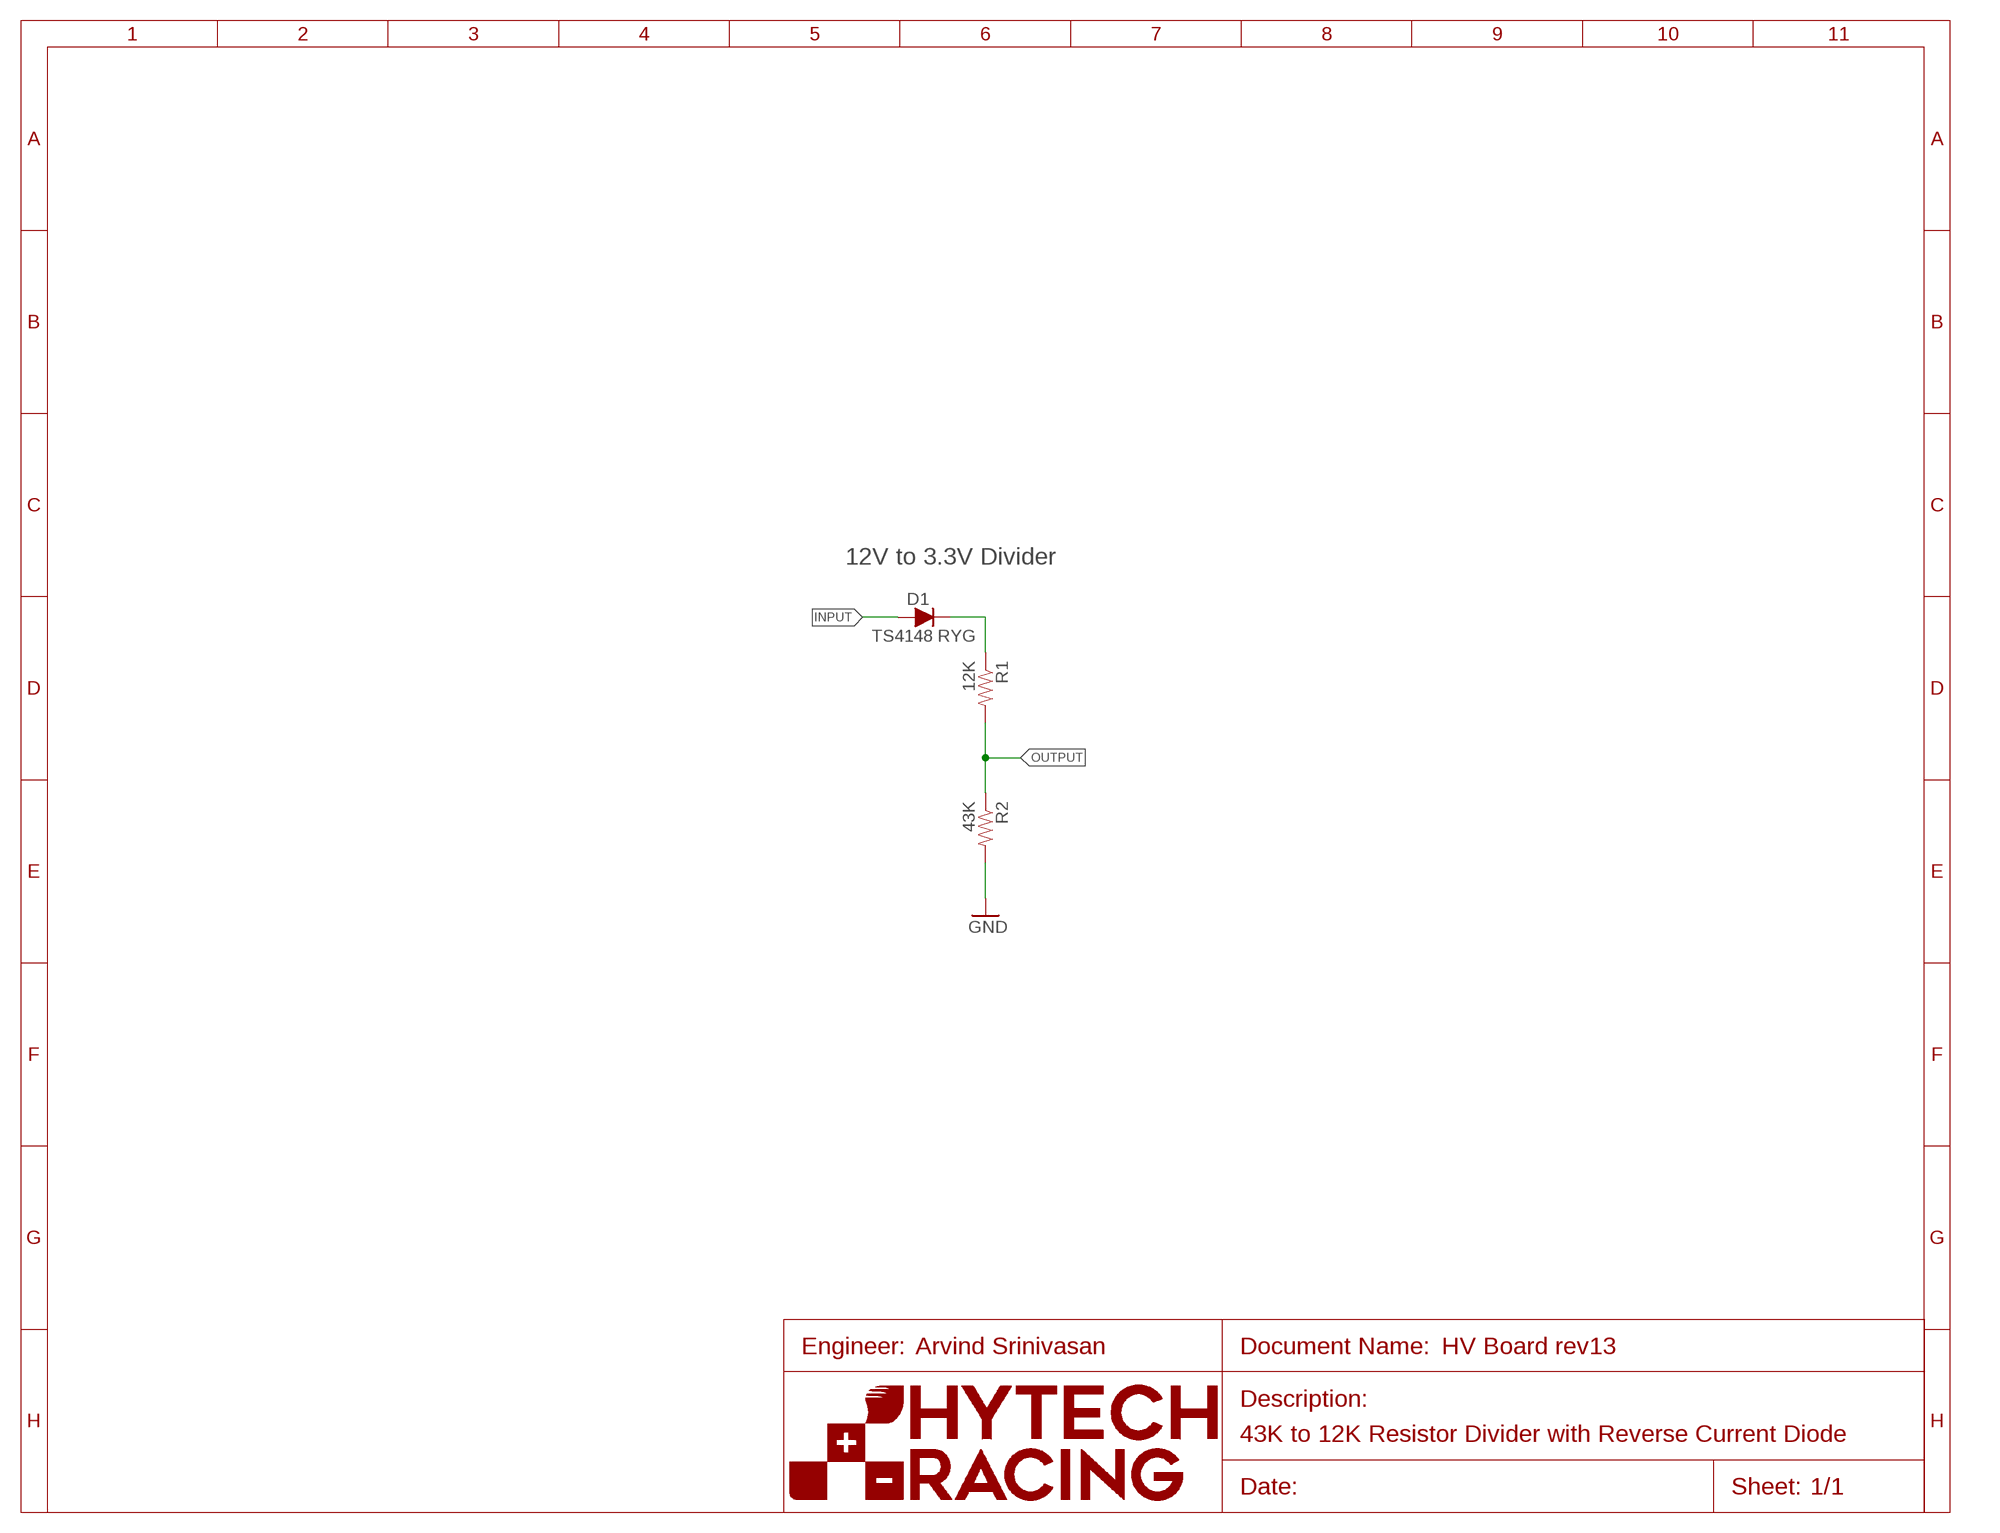
[diagram p3: schematic, module 43/12-RESISTOR-DIVIDER, sheet 1]
U$1 (FRAME_A): FRAME_DESCRIPTION: Default; ORIENTATION: LANDSCAPE; SIZE: A

### Parts
D1  TS4148 RYG  DIODE0805  [0805_D]
R1  12K  RESISTOR0603  [0603-RES]
R2  43K  RESISTOR0603  [0603-RES]

### Nets
GND: R2.2
INPUT: D1.A
INPUT_POST_DIODE: D1.C R1.1
OUTPUT: R1.2 R2.1

### Notes on the sheet
- 12V to 3.3V Divider
- Arvind Srinivasan
- 43K to 12K Resistor Divider with Reverse Current Diode

### Library data of the parts
D1 = HyTechDevices:DIODE: DIODE general purpose rectifier
R1 R2 = HyTechDevices:RESISTOR: Resistor Basic schematic elements and footprints for 0603, 1206, and PTH resistors.; TOLERANCE: 1%

## Module 10/10-RESISTOR-DIVIDER
Ports: INPUT(in) GND(pwr) OUTPUT(out)
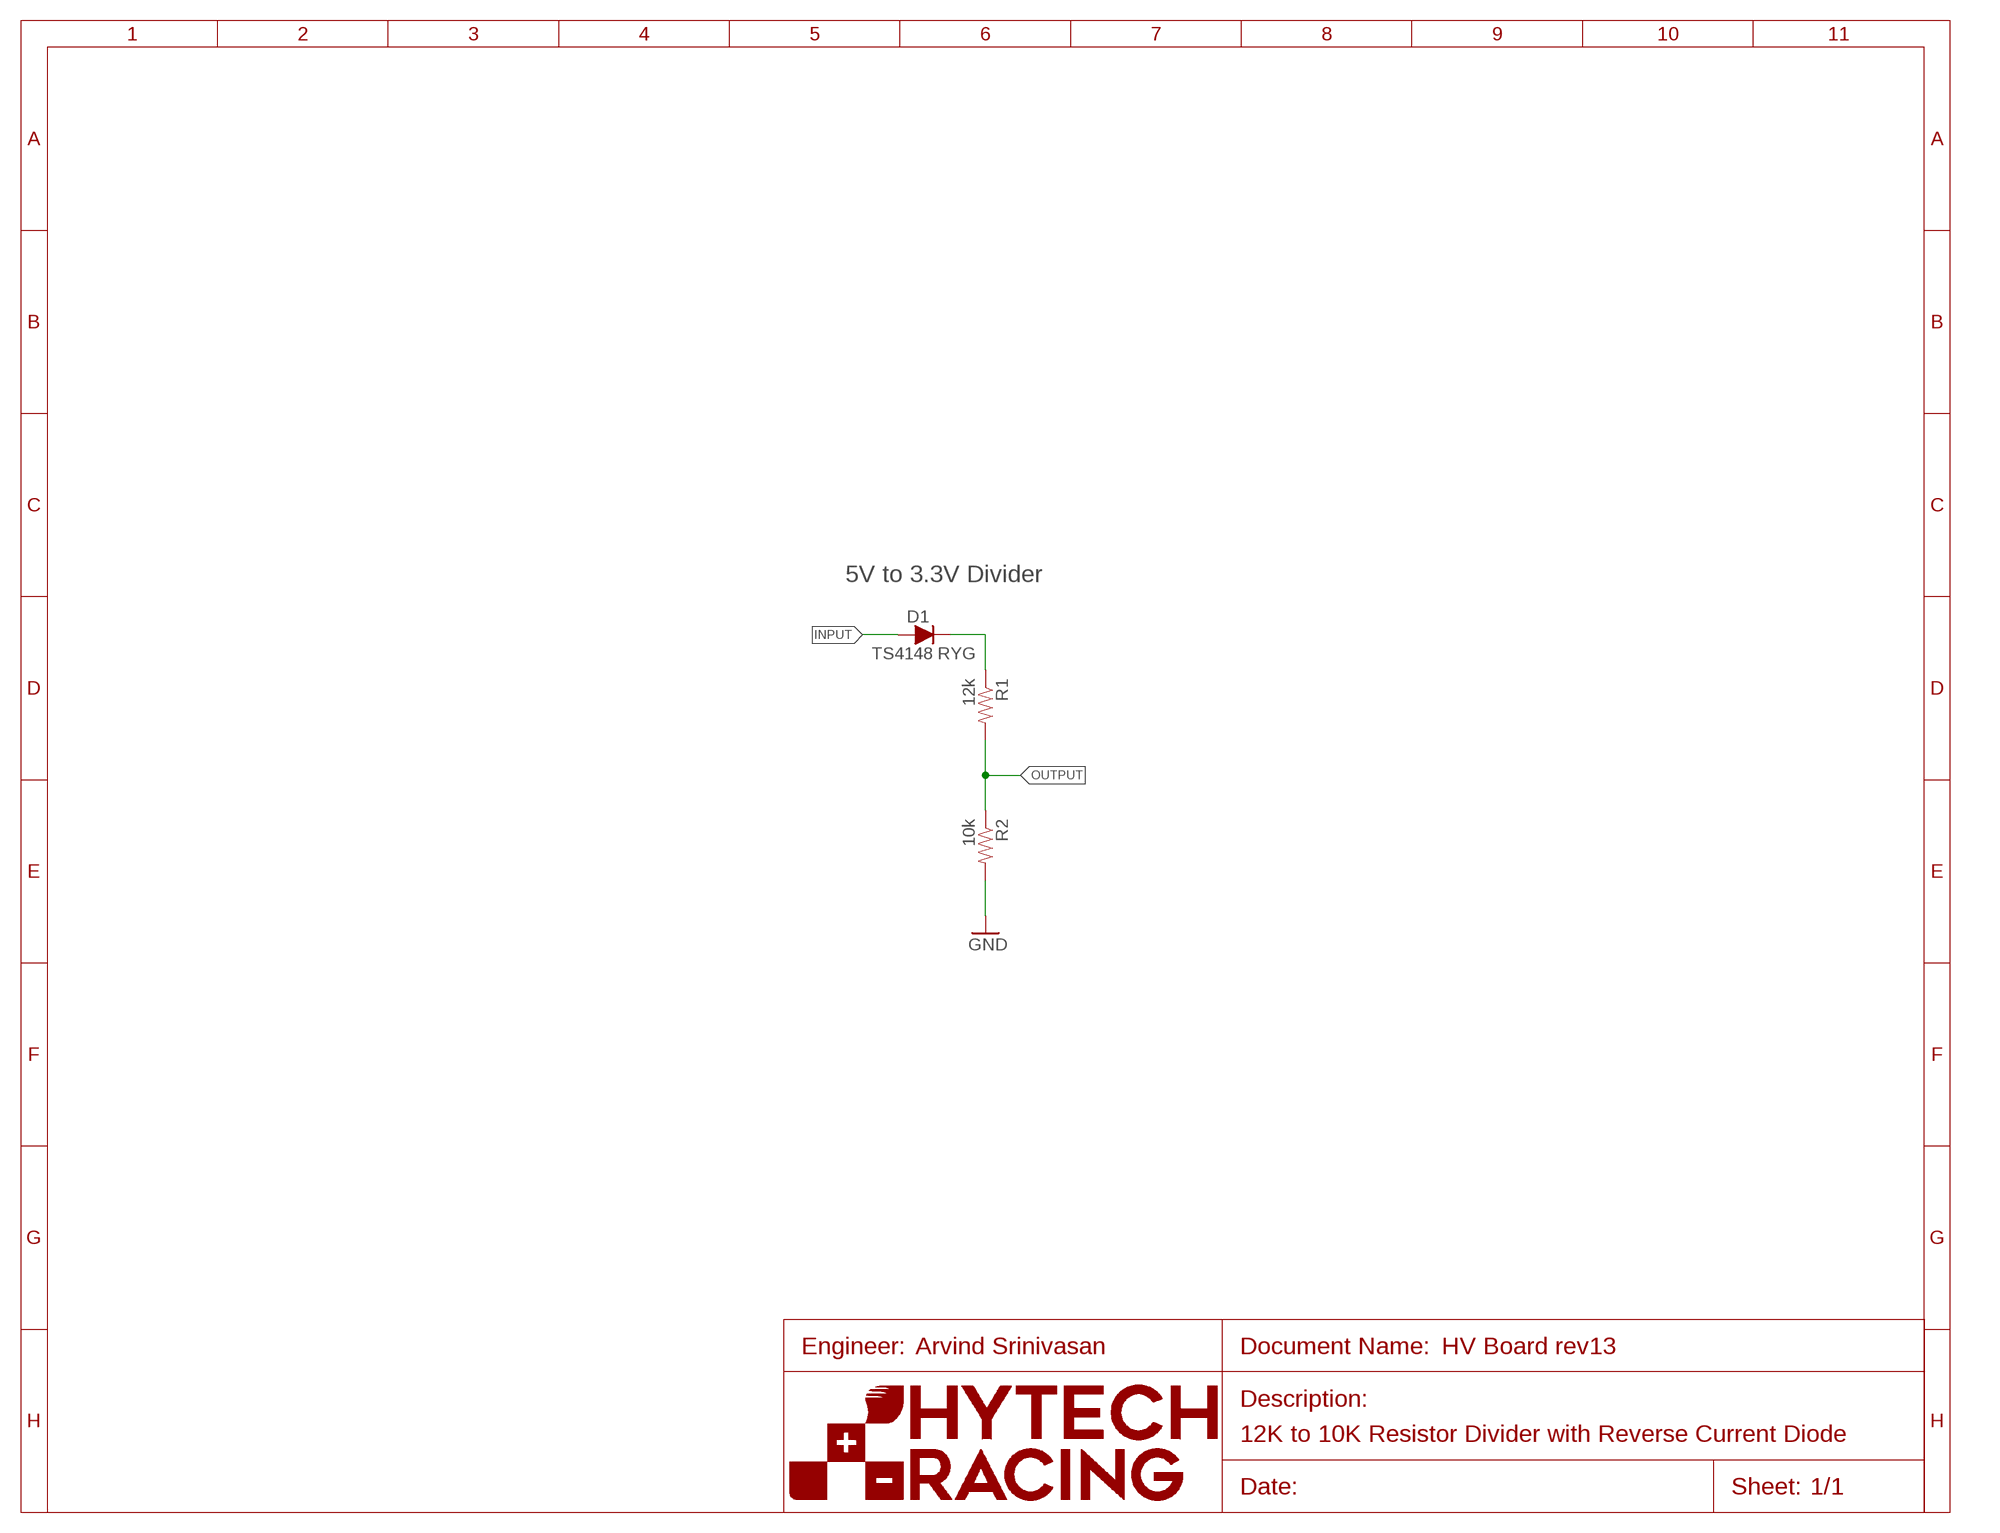
[diagram p4: schematic, module 10/10-RESISTOR-DIVIDER, sheet 1]
U$2 (FRAME_A): FRAME_DESCRIPTION: Default; ORIENTATION: LANDSCAPE; SIZE: A

### Parts
D1  TS4148 RYG  DIODE0805  [0805_D]
R1  12k  RESISTOR0603  [0603-RES]
R2  10k  RESISTOR0603  [0603-RES]

### Nets
GND: R2.2
INPUT: D1.A
INPUT_POST_DIODE: D1.C R1.1
OUTPUT: R1.2 R2.1

### Notes on the sheet
- 5V to 3.3V Divider
- Arvind Srinivasan
- 12K to 10K Resistor Divider with Reverse Current Diode

### Library data of the parts
D1 = HyTechDevices:DIODE: DIODE general purpose rectifier
R1 R2 = HyTechDevices:RESISTOR: Resistor Basic schematic elements and footprints for 0603, 1206, and PTH resistors.; TOLERANCE: 1%

## Module 1KHZ-FILTER
Ports: +5V(pwr) GND(pwr) OUTPUT(out) INPUT(in)
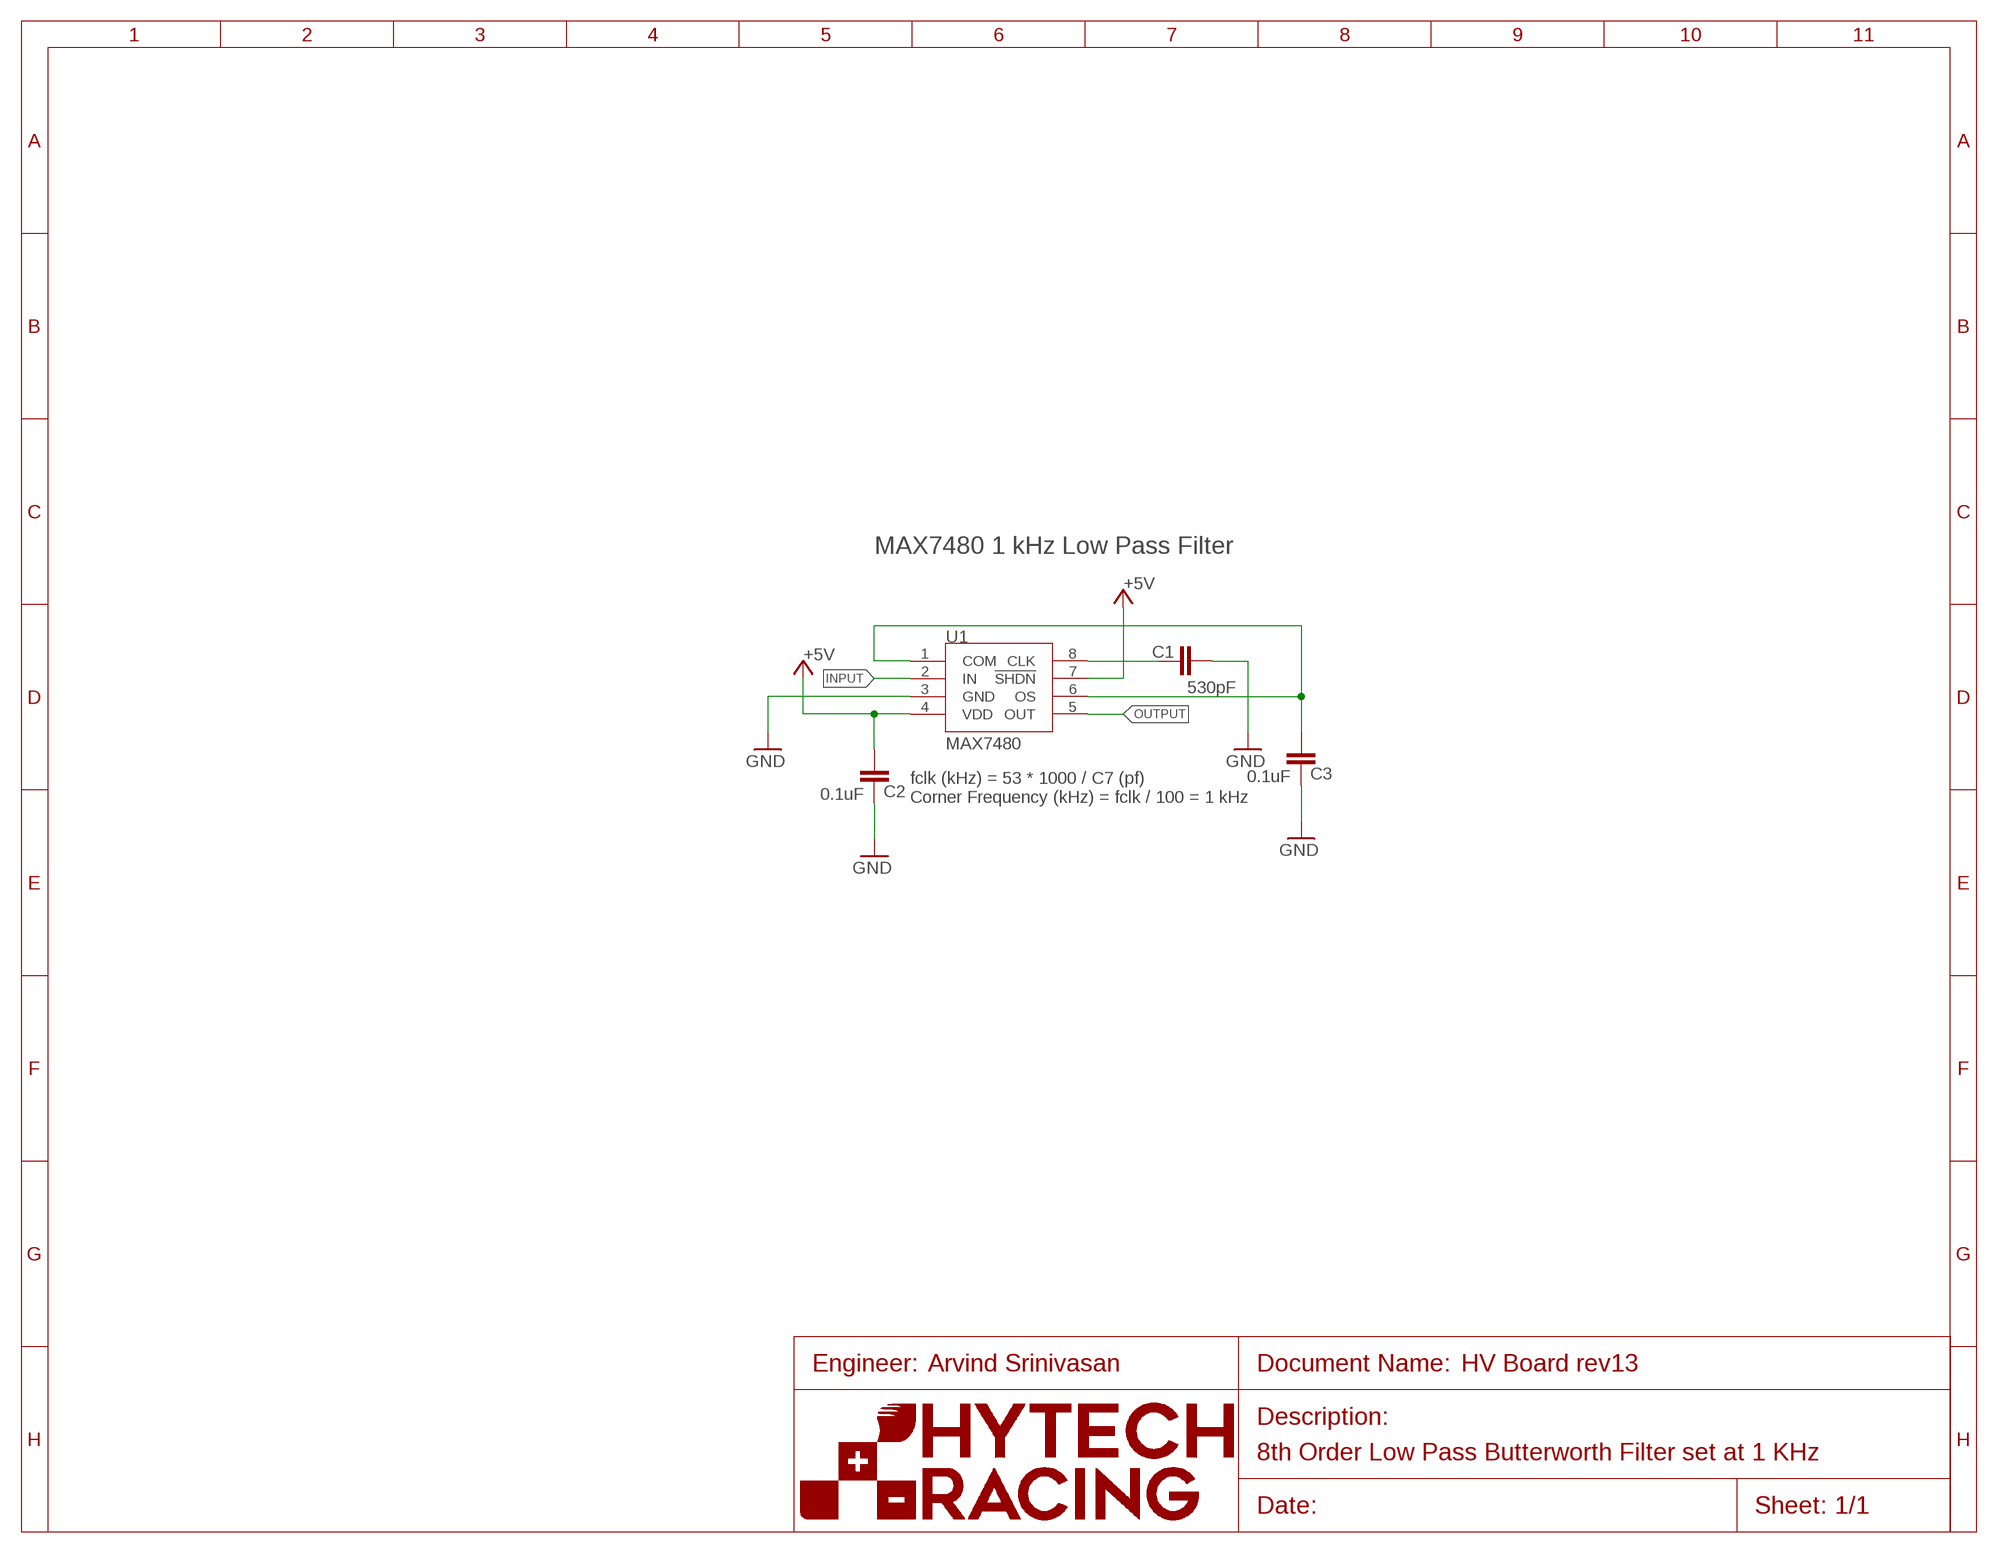
[diagram p5: schematic, module 1KHZ-FILTER, sheet 1]
U$2 (FRAME_A): FRAME_DESCRIPTION: Default; ORIENTATION: LANDSCAPE; SIZE: A

### Parts
C1  530pF  CAP0603-CAP  [0603-CAP]
C2  0.1uF  CAP0603-CAP  [0603-CAP]
C3  0.1uF  CAP0603-CAP  [0603-CAP]
U1  MAX7480  [SOIC-08]

### Nets
+5V: C2.1 U1.4(VDD) U1.7(!SHDN)
CLK: C1.1 U1.8(CLK)
COM: C3.1 U1.1(COM) U1.6(OS)
GND: C1.2 C2.2 C3.2 U1.3(GND)
INPUT: U1.2(IN)
OUTPUT: U1.5(OUT)

### Notes on the sheet
- MAX7480 1 kHz Low Pass Filter
- fclk (kHz) = 53 * 1000 / C7 (pf)
  Corner Frequency (kHz) = fclk / 100 = 1 kHz
- Arvind Srinivasan
- 8th Order Low Pass Butterworth Filter set at 1 KHz

### Library data of the parts
C1 = HyTechDevices:CAP: Capacitor Standard 0603 ceramic capacitor, and 0.1" leaded capacitor.; TOLERANCE: 1%; VOLTAGE: 10V
C2 C3 = HyTechDevices:CAP: Capacitor Standard 0603 ceramic capacitor, and 0.1" leaded capacitor.; TOLERANCE: 5%; VOLTAGE: 10V
U1 = HyTechDevices:MAX7480: 8th-order lowpass butterworth filter

## Net classes
1 TS: clearance 2.25 mm to class 0
2 ISO_SPI: clearance 2.25 mm to class 0, clearance 2.25 mm to class 1

## Board
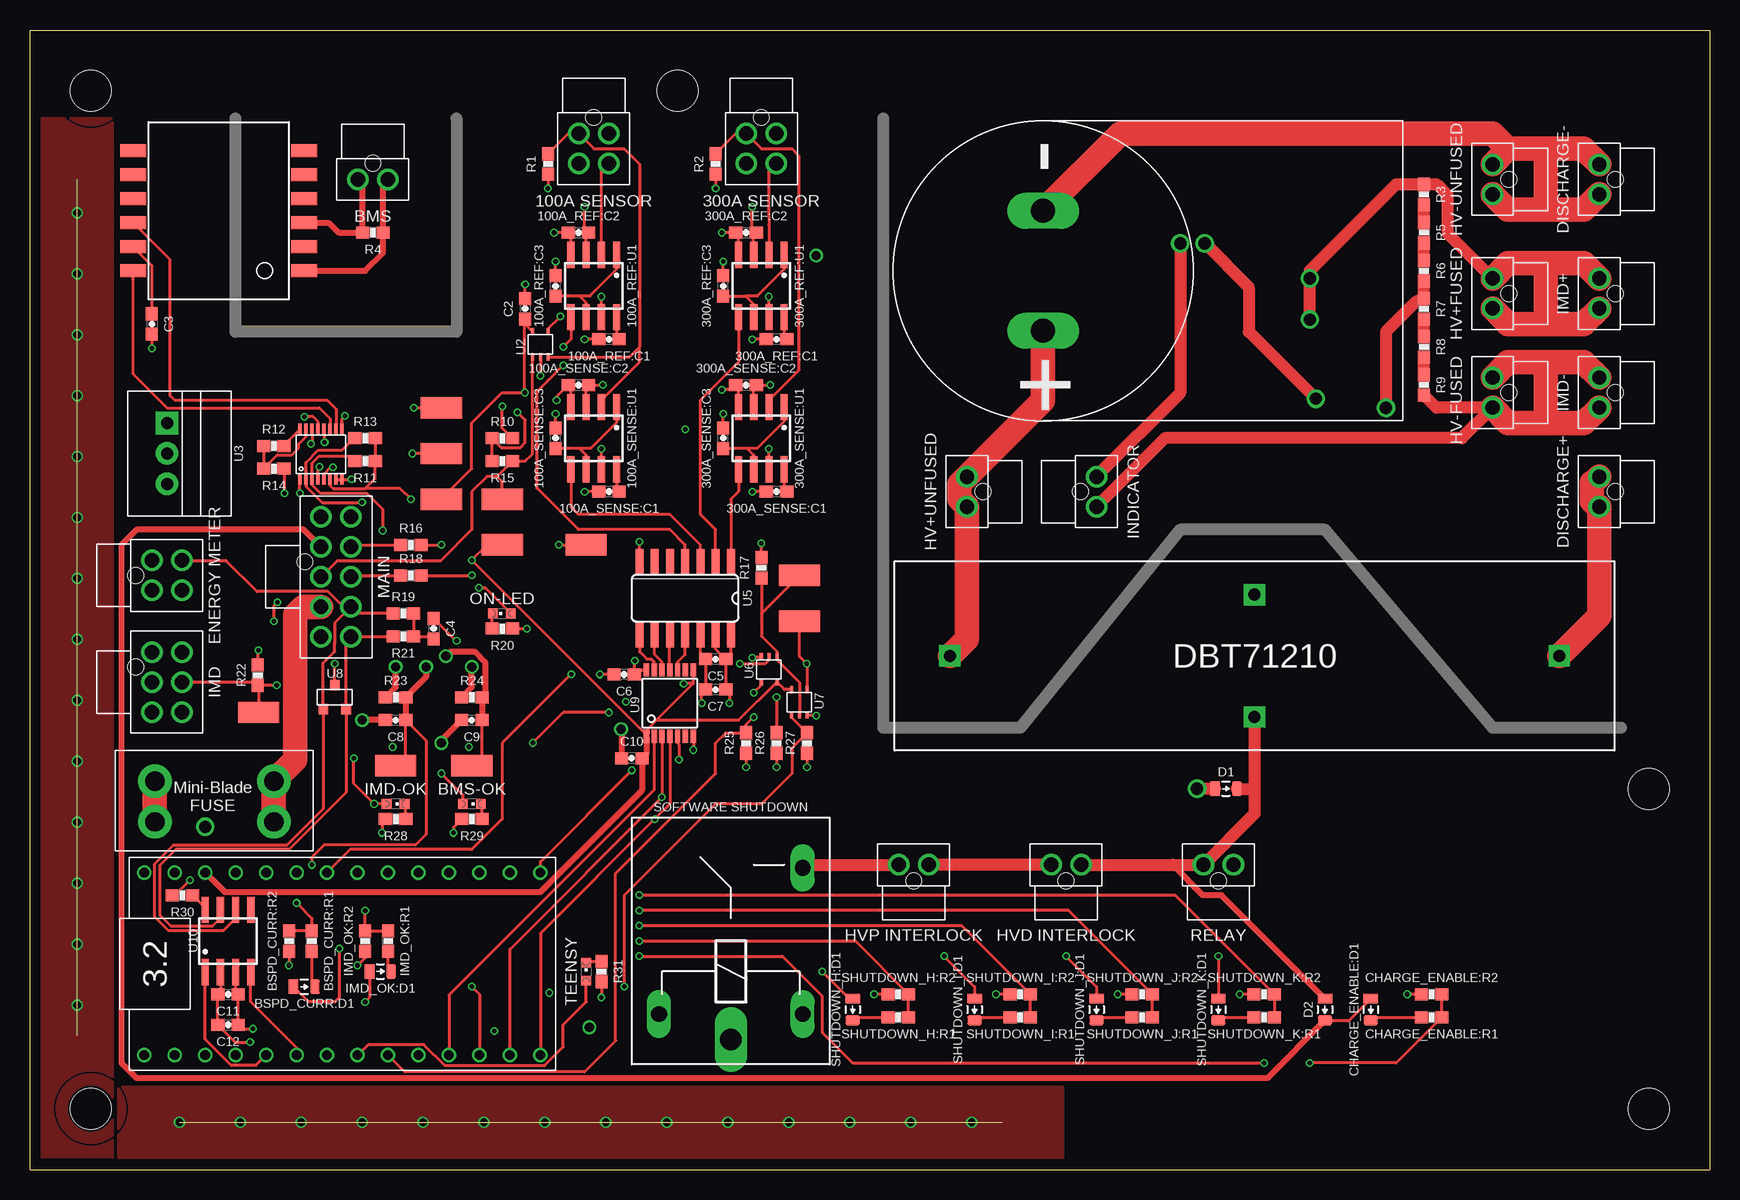
[diagram p6: board, top side]
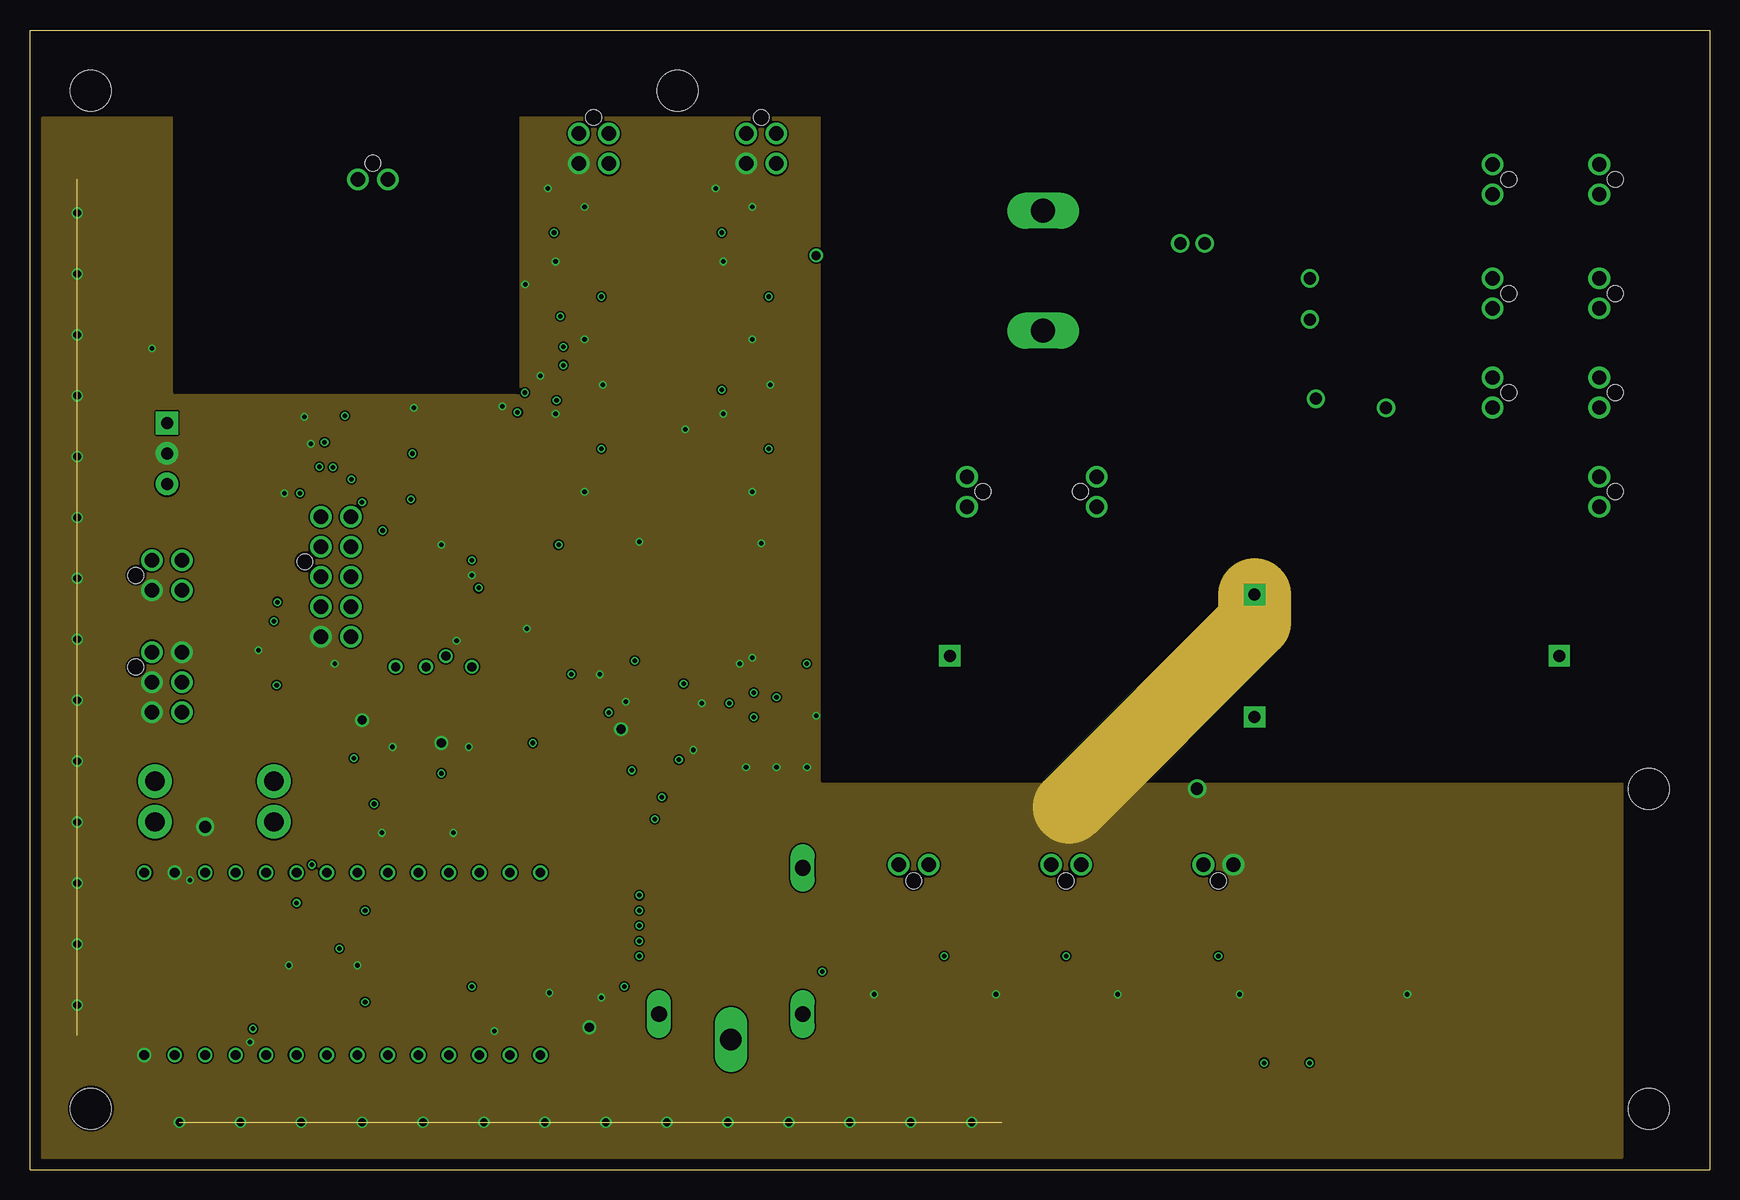
[diagram p7: board, inner layer Route2]
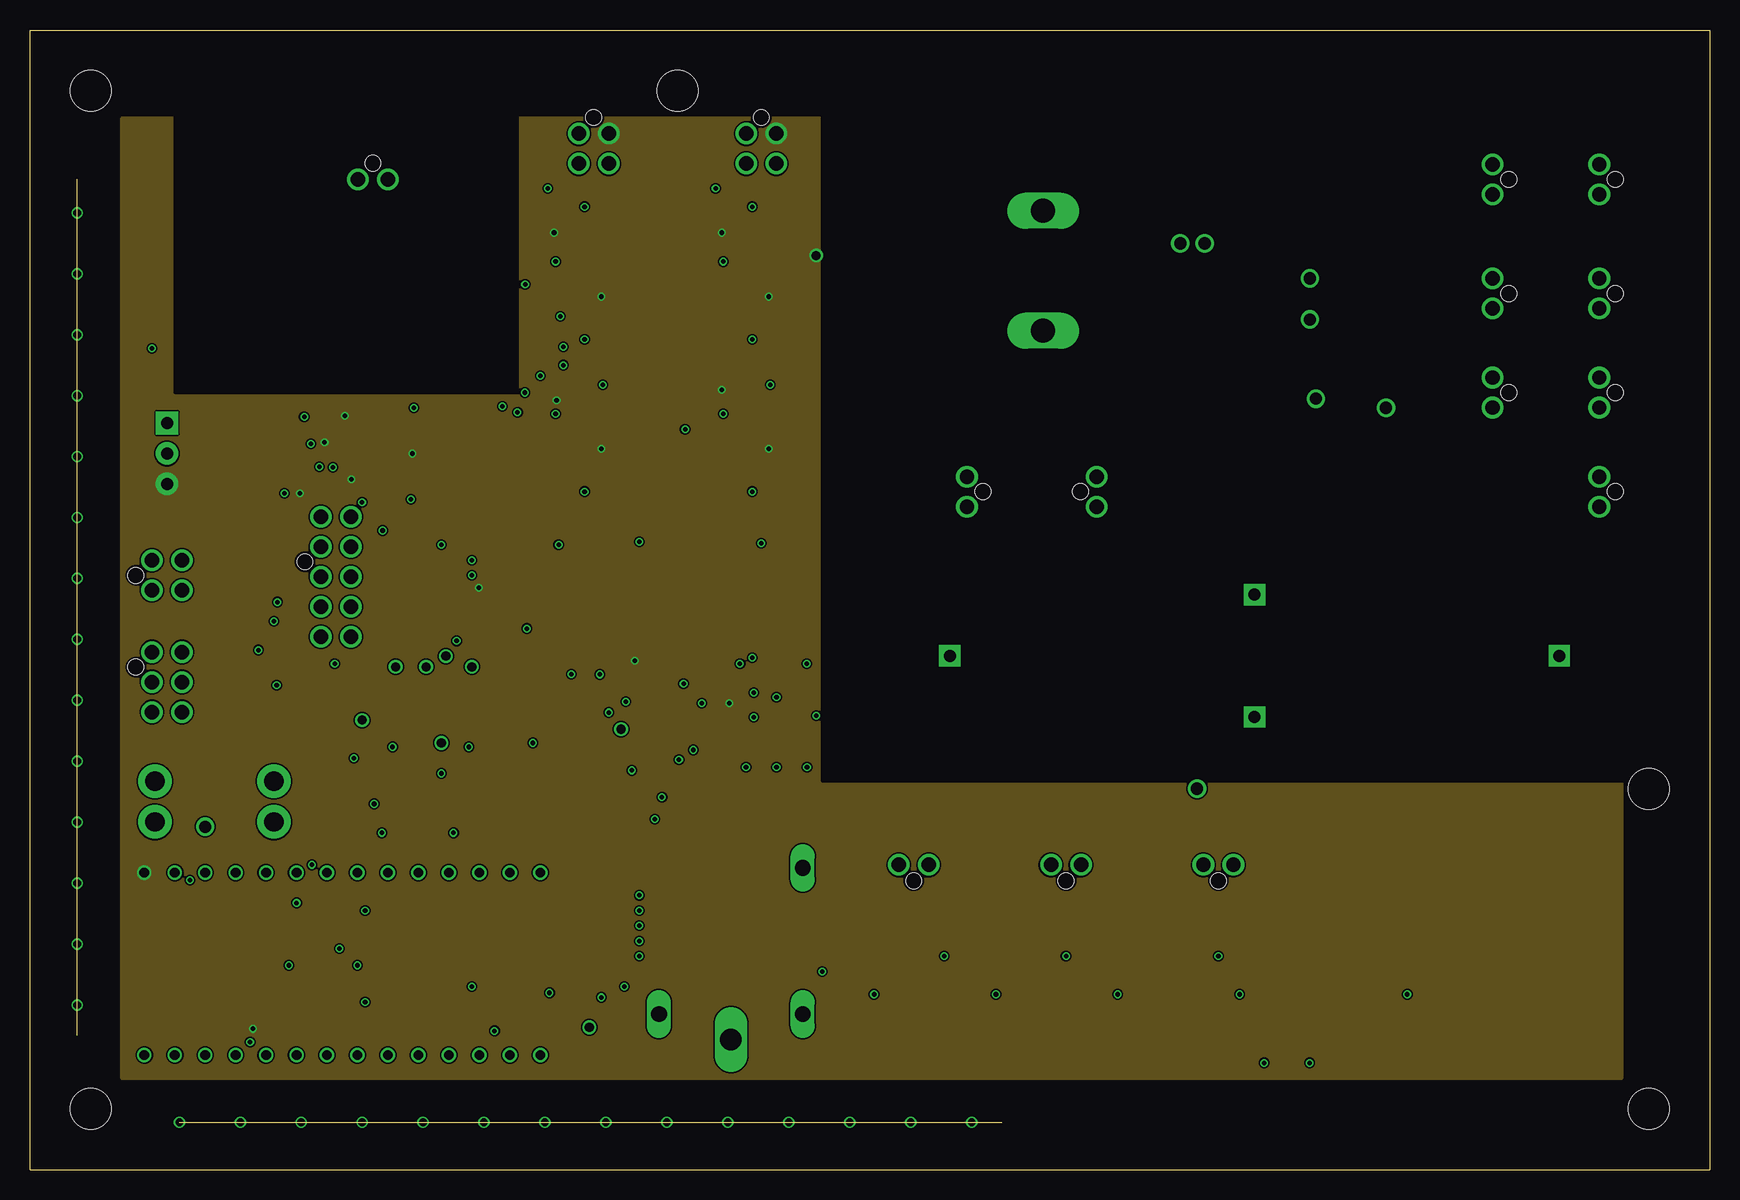
[diagram p8: board, inner layer Route15]
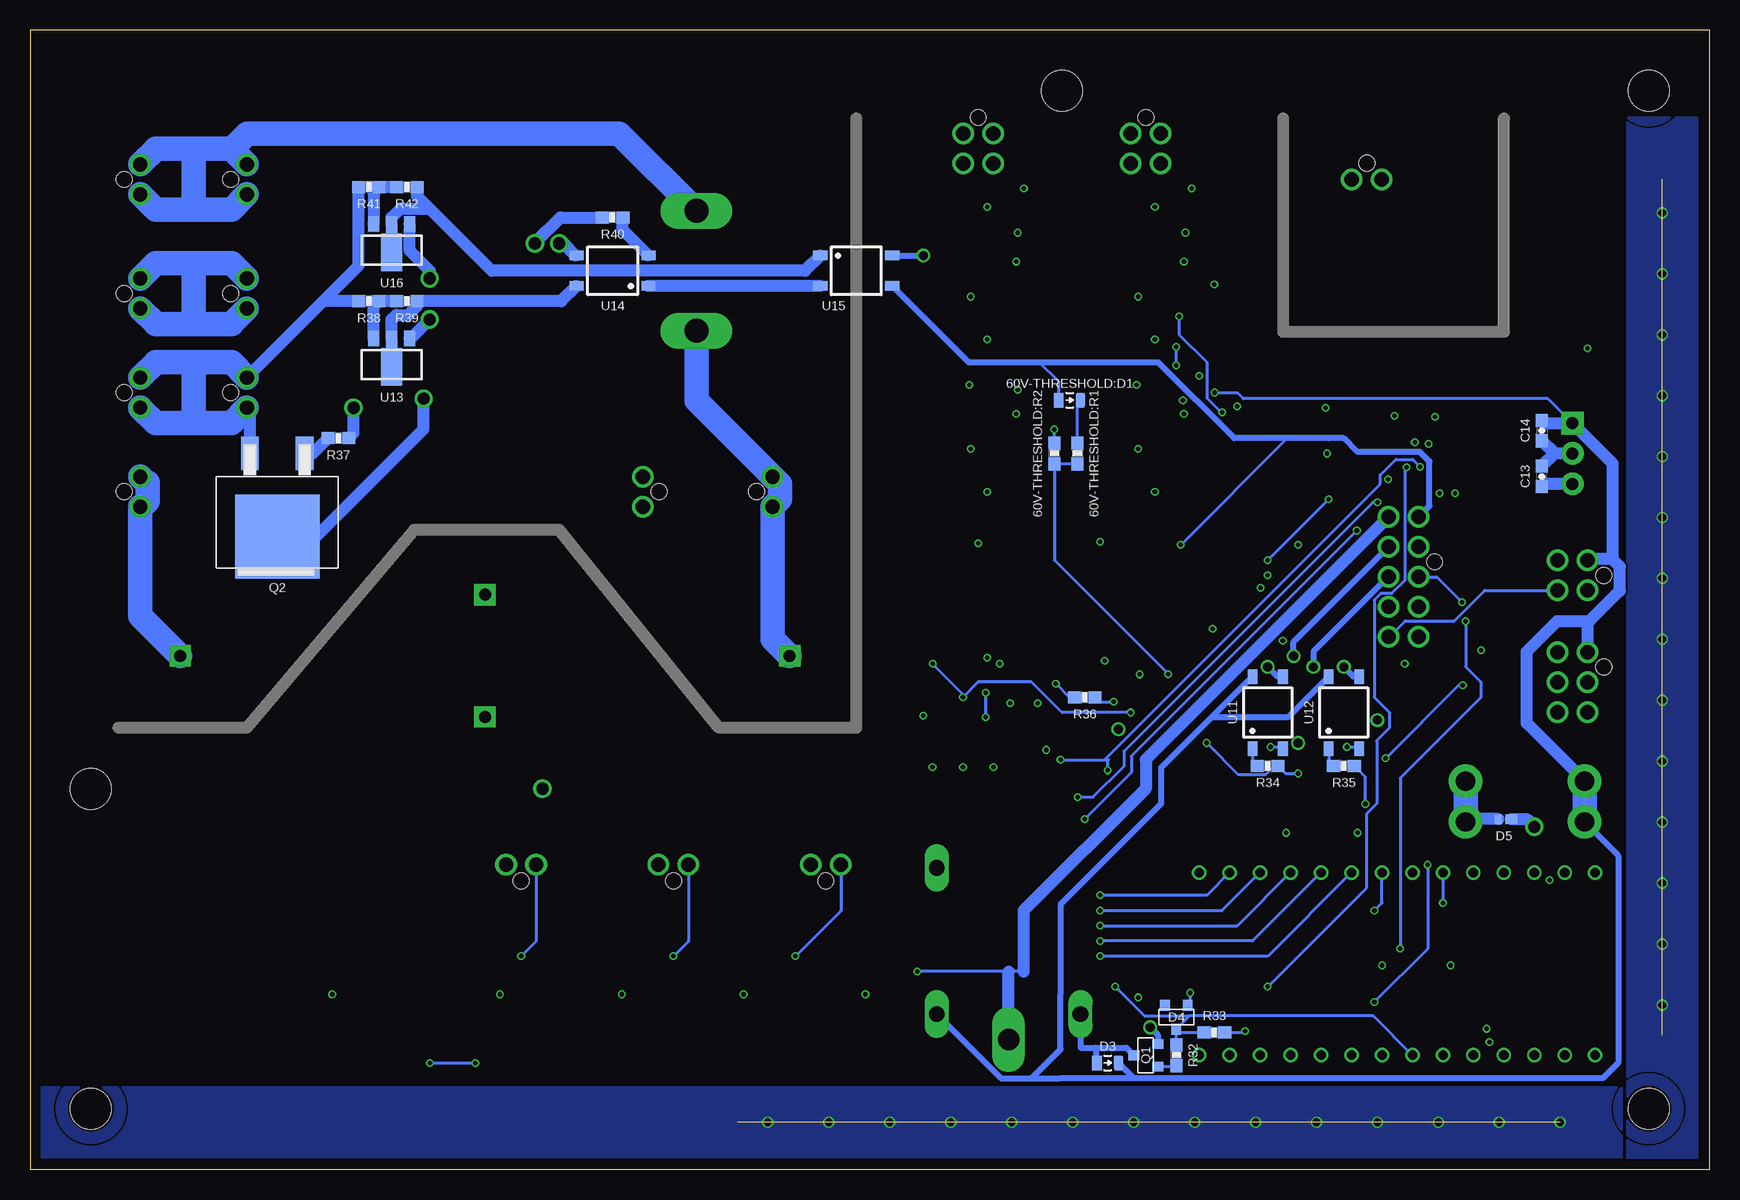
[diagram p9: board, bottom side, seen from below]

Size 140 x 95 mm. Coordinates in mm from the lower left corner, seen from the top.
Outline: 0,0 140,0 140,95 0,95 0,0
Copper layers (1+2*15+16): Top 0.035mm / dielectric 0.2mm / Route2 0.0175mm / dielectric 1.065mm / Route15 0.0175mm / dielectric 0.2mm / Bottom 0.035mm
Design rules "JLCPCB (4 Layer) *": minimum track width 5mil, minimum drill 0.2mm, track to track 5mil, track to pad 5mil, pad to pad 5mil, via to via 20mil, smd to smd 5mil, copper to edge 0.2mm, drill to drill 21mil, minimum pad ring 6mil, minimum via ring 5mil, stop-mask expansion 6mil, vias tented up to drill 30mil, thermal gap 10mil
Milling: 2 lines

### Footprints (pad centres in the part's own frame; a part is rotated, then mirrored left to right if it is on the bottom)
0805_D = smd 0.8 x 1.2: A -0.9,0; C 0.9,0
0603-RES = smd 1.1 x 1: 1 -0.85,0; 2 0.85,0
0603-CAP = smd 1.1 x 1: 1 -0.85,0; 2 0.85,0
SOIC-08 = smd 0.6 x 2.2: 1 -1.905,-2.6; 2 -0.635,-2.6; 3 0.635,-2.6; 4 1.905,-2.6; 5 1.905,2.6; 6 0.635,2.6; 7 -0.635,2.6; 8 -1.905,2.6
M3_MOUNTING = hole 3.4: 0,0
DBT71210 = drill 1 pad 1.778 square: COIL+ 30,-13; COIL- 30,-2.8; CONTACT1 55.4,-7.9; CONTACT2 4.6,-7.9
LED-603 = smd 0.8 x 0.8: A 0,-0.75; C 0,0.75
MINI-BLADE_FUSE_HOLDER = drill 1.613 pad 2.794: L1 0,3.404; L2 0,0; R1 9.906,3.404; R2 9.906,0
LLS2V181MELA = drill 2 long: P$1 -5,0; P$2 5,0
NANO-FIT_VERTICAL-4 = drill 1.2: P$1 -1.25,0; P$2 1.25,0; P$3 -1.25,2.5; P$4 1.25,2.5 | hole 1.3: 0,-1.34
SOT23 = smd 0.8 x 0.9: 1 -0.95,-1; 2 0.95,-1; 3 0,1
U-DFN1608-2 = smd 0.8 x 1.011: P$1 0,0 | smd 0.8 x 0.61: P$2 0,-1.092
NANO-FIT_VERTICAL-2 = drill 1.2: P$1 -1.25,0; P$2 1.25,0 | hole 1.3: 0,-1.34
NANO-FIT_VERTICAL-6 = drill 1.2: P$1 -2.5,0; P$2 0,0; P$3 2.5,0; P$4 -2.5,2.5; P$5 0,2.5; P$6 2.5,2.5 | hole 1.3: -1.25,-1.34
NANO-FIT_VERTICAL-10 = drill 1.2: P$1 -5,0; P$2 -2.5,0; P$3 0,0; P$4 2.5,0; P$5 5,0; P$6 -5,2.5; P$7 -2.5,2.5; P$8 0,2.5; P$9 2.5,2.5; P$10 5,2.5 | hole 1.3: -1.27,-1.34
TO-252 = smd 1.499 x 2.794: 1 -2.286,0; 3 2.286,0 | smd 7.01 x 7.01: 2(TAB) 0,6.909
G5LE-1A4 = drill 1.321 long: 1 4.064,14.884; 2 4.064,2.896; S 16.256,2.896 | drill 1.803 long: P 1.956,8.89
TEENSY_3.2_SIMPLE = drill 0.8: 3.3V 16.51,29.21; A0 16.51,3.81; A1 16.51,6.35; A2 16.51,8.89; A3 16.51,11.43; A4 16.51,13.97; A5 16.51,16.51; A6 16.51,19.05; A7 16.51,21.59; A8 16.51,24.13; A9 16.51,26.67; AGND 16.51,31.75; D0(RX1) 1.27,31.75; D1(TX1) 1.27,29.21; D2 1.27,26.67; D3(CANTX) 1.27,24.13; D4(CANRX) 1.27,21.59; D5 1.27,19.05; D6 1.27,16.51; D7(RX3) 1.27,13.97; D8(TX3) 1.27,11.43; D9(RX2) 1.27,8.89; D10(TX2) 1.27,6.35; D11 1.27,3.81; D12 1.27,1.27; D13 16.51,1.27; GND 1.27,34.29; VIN 16.51,34.29
HM2102NLT = smd 1.067 x 2.184: P$1 0,0; P$2 2,0; P$3 4,0; P$4 6,0; P$5 8,0; P$6 10,0; P$7 10,14.25; P$8 8,14.25; P$9 6,14.25; P$10 4,14.25; P$11 2,14.25; P$12 0,14.25
SOT323-5 = smd 0.61 x 0.254: 1 -2.108,1.295; 2 -2.108,0.635; 3 -2.108,0; 4 0,0; 5 0,1.295
OKI-78SR = drill 1 pad 1.88 square: 1 -2.54,0 | drill 1 pad 1.88: 2 0,0; 3 2.54,0
MSOP-16 = smd 0.305 x 0.889: 1 -0.1,-0.5; 2 0.4,-0.5; 3 0.9,-0.5; 4 1.4,-0.5; 5 1.9,-0.5; 6 2.4,-0.5; 7 2.9,-0.5; 8 3.4,-0.5; 9 3.4,3.7; 10 2.9,3.7; 11 2.4,3.7; 12 1.9,3.7; 13 1.4,3.7; 14 0.9,3.7; 15 0.4,3.7; 16 -0.1,3.7
SO14 = smd 0.66 x 2.032: 1 -3.81,-3.073; 2 -2.54,-3.073; 3 -1.27,-3.073; 4 0,-3.073; 5 1.27,-3.073; 6 2.54,-3.073; 7 3.81,-3.073; 8 3.81,3.073; 9 2.54,3.073; 10 1.27,3.073; 11 0,3.073; 12 -1.27,3.073; 13 -2.54,3.073; 14 -3.81,3.073
TSSOP-14 = smd 0.45 x 1.1: 1 -1.958,-2.618; 2 -1.308,-2.618; 3 -0.657,-2.618; 4 -0.007,-2.618; 5 0.642,-2.618; 6 1.292,-2.618; 7 1.942,-2.618; 8 1.942,2.918; 9 1.292,2.918; 10 0.642,2.918; 11 -0.007,2.918; 12 -0.657,2.918; 13 -1.308,2.918; 14 -1.958,2.918
SOP04 = smd 0.8 x 1.2: 1 -1.27,-3; 2 1.27,-3; 3 1.27,3; 4 -1.27,3
SOT89 = smd 0.9 x 1.3: 1 -1.5,-1.357; 3 1.5,-1.357 | smd 0.9 x 1.475: 2 0,-1.27 | smd 1.733 x 3.125: PAD 0,1.03
MICRO_MINIATURE = smd 3.429 x 1.778: P$1 0,0

### Placement (x,y rotation side)
60V-THRESHOLD:D1  TS4148 RYG  [0805_D]  53.34,64.14 0 bottom
60V-THRESHOLD:R1  12k  [0603-RES]  52.7,59.69 270 bottom
60V-THRESHOLD:R2  10k  [0603-RES]  54.61,59.69 90 bottom
100A_REF:C1  530pF  [0603-CAP]  48.26,69.22 180 top
100A_REF:C2  0.1uF  [0603-CAP]  45.72,78.11 0 top
100A_REF:C3  0.1uF  [0603-CAP]  43.81,73.66 90 top
100A_REF:U1  MAX7480  [SOIC-08]  46.99,73.66 180 top
100A_SENSE:C1  530pF  [0603-CAP]  48.26,56.52 180 top
100A_SENSE:C2  0.1uF  [0603-CAP]  45.72,65.41 0 top
100A_SENSE:C3  0.1uF  [0603-CAP]  43.81,60.96 90 top
100A_SENSE:U1  MAX7480  [SOIC-08]  46.99,60.96 180 top
300A_REF:C1  530pF  [0603-CAP]  62.23,69.22 180 top
300A_REF:C2  0.1uF  [0603-CAP]  59.69,78.11 0 top
300A_REF:C3  0.1uF  [0603-CAP]  57.78,73.66 90 top
300A_REF:U1  MAX7480  [SOIC-08]  60.96,73.66 180 top
300A_SENSE:C1  530pF  [0603-CAP]  62.23,56.52 180 top
300A_SENSE:C2  0.1uF  [0603-CAP]  59.69,65.41 0 top
300A_SENSE:C3  0.1uF  [0603-CAP]  57.78,60.96 90 top
300A_SENSE:U1  MAX7480  [SOIC-08]  60.96,60.96 180 top
$$U$1  [M3_MOUNTING]  5.08,89.92 0 top
$$U$2  [M3_MOUNTING]  53.98,89.92 0 top
$$U$12  132.08,34.92 180 top
BMS-OK  36.83,30.48 270 top
BOARDFUSE  20.32,32.38 180 top
BSPD_CURR:D1  TS4148 RYG  [0805_D]  22.86,15.24 0 top
BSPD_CURR:R1  12K  [0603-RES]  23.5,19.05 90 top
BSPD_CURR:R2  43K  [0603-RES]  21.59,19.05 270 top
C1  84.45,74.93 90 top
C2  41.27,71.75 270 top
C3  10.16,70.48 270 top
C4  33.66,45.09 270 top
C5  57.15,42.55 180 top
C6  49.53,41.27 180 top
C7  57.15,40.01 180 top
C8  30.48,37.47 0 top
C9  36.83,37.47 0 top
C10  50.16,34.29 180 top
C11  16.51,14.61 0 top
C12  16.51,12.06 0 top
C13  13.97,57.78 90 bottom
C14  13.97,61.59 270 bottom
CHARGE_ENABLE:D1  TS4148 RYG  [0805_D]  111.76,13.34 270 top
CHARGE_ENABLE:R1  12K  [0603-RES]  116.84,12.7 0 top
CHARGE_ENABLE:R2  43K  [0603-RES]  116.84,14.61 180 top
CURRENT1  46.99,86.36 180 top
CURRENT2  60.96,86.36 180 top
D1  99.69,31.75 0 top
D2  107.95,13.34 270 top
D3  50.16,8.89 0 bottom
D4  44.45,12.7 180 bottom
D5  16.51,29.21 270 bottom
DISCHARGE+  130.81,56.52 90 top
DISCHARGE-  130.81,82.55 90 top
ENERGYMETER  10.16,49.53 270 top
HV+FUSED  121.92,73.03 90 top
HV+UNFUSED  78.11,56.52 90 top
HV-FUSED  121.92,64.77 90 top
HV-UNFUSED  121.92,82.55 90 top
IMD  10.16,40.64 270 top
IMD+  130.81,73.03 90 top
IMD-  130.81,64.77 90 top
IMD-OK  30.48,30.48 270 top
IMD_OK:D1  TS4148 RYG  [0805_D]  29.21,16.51 0 top
IMD_OK:R1  12K  [0603-RES]  29.84,19.05 90 top
IMD_OK:R2  43K  [0603-RES]  27.94,19.05 270 top
INDICATOR  88.9,56.52 270 top
INTERLOCK1  73.66,25.4 0 top
INTERLOCK2  86.36,25.4 0 top
ISOSPI  28.57,82.55 180 top
MAIN  24.26,49.4 270 top
ON-LED  39.34,46.35 90 top
Q1  46.99,9.53 90 bottom
Q2  119.38,59.69 180 bottom
R1  43.18,83.82 270 top
R2  57.15,83.82 270 top
R3  116.2,81.28 90 top
R4  28.57,78.11 180 top
R5  116.2,78.11 270 top
R6  116.2,74.93 90 top
R7  116.2,71.75 90 top
R8  116.2,68.58 270 top
R9  116.2,65.41 90 top
R10  39.37,60.96 0 top
R11  27.94,60.96 180 top
R12  20.32,60.33 180 top
R13  27.94,59.05 180 top
R14  20.32,58.42 0 top
R15  39.37,59.05 0 top
R16  31.75,52.07 0 top
R17  60.96,50.16 270 top
R18  31.75,49.53 0 top
R19  31.11,46.35 180 top
R20  39.37,45.09 0 top
R21  31.11,44.45 180 top
R22  19,41.22 90 top
R23  30.48,39.37 0 top
R24  36.83,39.37 0 top
R25  59.69,35.56 270 top
R26  62.23,35.56 90 top
R27  64.77,35.56 90 top
R28  30.48,29.21 180 top
R29  36.83,29.21 180 top
R30  12.7,22.86 0 top
R31  47.62,16.51 270 top
R32  44.45,9.53 90 bottom
R33  41.27,11.43 0 bottom
R34  36.83,33.66 180 bottom
R35  30.48,33.66 180 bottom
R36  52.07,39.37 0 bottom
R37  114.3,60.96 180 bottom
R38  111.76,72.39 180 bottom
R39  108.58,72.39 0 bottom
R40  91.44,79.38 180 bottom
R41  111.76,81.92 180 bottom
R42  108.58,81.92 0 bottom
RELAY  99.06,25.4 0 top
SHUTDOWN_H:D1  TS4148 RYG  [0805_D]  68.58,13.34 270 top
SHUTDOWN_H:R1  12K  [0603-RES]  72.39,12.7 0 top
SHUTDOWN_H:R2  43K  [0603-RES]  72.39,14.61 180 top
SHUTDOWN_I:D1  TS4148 RYG  [0805_D]  78.74,13.34 270 top
SHUTDOWN_I:R1  12K  [0603-RES]  82.55,12.7 0 top
SHUTDOWN_I:R2  43K  [0603-RES]  82.55,14.61 180 top
SHUTDOWN_J:D1  TS4148 RYG  [0805_D]  88.9,13.34 270 top
SHUTDOWN_J:R1  12K  [0603-RES]  92.71,12.7 0 top
SHUTDOWN_J:R2  43K  [0603-RES]  92.71,14.61 180 top
SHUTDOWN_K:D1  TS4148 RYG  [0805_D]  99.06,13.34 270 top
SHUTDOWN_K:R1  12K  [0603-RES]  102.87,12.7 0 top
SHUTDOWN_K:R2  43K  [0603-RES]  102.87,14.61 180 top
SOFTWARE_SHUTDOWN  67.31,8.89 90 top
TEENSY  46.35,16.51 0 top
TEENSY3.1  43.81,8.26 90 top
U1  22.86,74.93 90 top
U2  43.18,69.85 90 top
U3  11.43,59.69 270 top
U4  22.61,58.04 0 top
U5  54.61,47.62 180 top
U6  60.96,40.64 270 top
U7  64.77,40.01 90 top
U8  25.4,39.37 0 top
U9  53.34,38.73 0 top
U10  16.51,19.05 0 top
U11  36.83,38.1 0 bottom
U12  30.48,38.1 0 bottom
U13  109.86,67.94 180 bottom
U14  91.44,74.93 90 bottom
U15  71.12,74.93 270 bottom
U16  109.86,77.47 180 bottom
U$3  34.29,63.5 0 top
U$4  34.29,59.69 0 top
U$5  34.29,55.88 0 top
U$6  39.37,55.88 0 top
U$7  39.37,52.07 0 top
U$8  46.35,52.07 0 top
U$9  64.14,49.53 0 top
U$10  64.14,45.72 0 top
U$11  19.05,38.1 0 top
U$13  30.48,33.66 0 top
U$14  36.83,33.66 0 top
U$15  [M3_MOUNTING]  134.92,31.75 0 top
U$16  [M3_MOUNTING]  5.08,5.08 0 top
U$17  [M3_MOUNTING]  134.92,5.08 0 top

### Tracks (layer width: path | path; a pad name or v marks a point on that pad's centre or on a via)
60V-THRESHOLD:INPUT_POST_DIODE
  Bottom 0.254: 60V-THRESHOLD:R1.1 52.7,63.87 60V-THRESHOLD:D1.C
60V_THRESHOLD_SIGNAL  (via drill 0.38)
  Top 0.254: v44.07,52.07 U$8.P$1
  Bottom 0.254: v44.07,52.07 35.18,60.96 31.75,60.96 | 60V-THRESHOLD:D1.A 54.24,65.67 55.88,67.31
  Bottom 0.508: MAIN.P$1 23.35,55.31 23.35,59.03 24.13,59.82 29.34,59.82 30.48,60.96 31.75,60.96 39.62,60.96 45.97,67.31 55.88,67.31 61.77,67.31 U15.3
60V_THRESHOLD_TEENSY  (via drill 0.38)
  Top 0.254: v45.11,41.3 39.37,35.56 39.37,29.21 36.83,26.67 26.67,26.67 TEENSY3.1.A6
  Bottom 0.254: 60V-THRESHOLD:R1.2 60V-THRESHOLD:R2.1 54.61,50.8 v45.11,41.3
100A_REF
  Top 0.254: 100A_REF:U1.2 47.62,83.25 CURRENT1.P$3
100A_REF:CLK
  Top 0.254: 100A_REF:U1.8 48.9,69.43 100A_REF:C1.1
100A_REF:COM
  Top 0.254: 100A_REF:U1.6 46.35,72.26 45.81,72.81 | 45.81,72.81 100A_REF:C3.1 | 45.81,72.81 46.65,72.81 48.9,75.06 100A_REF:U1.1
100A_REF_FILT  (via drill 0.38)
  Top 0.254: v44.45,67.06 43.18,65.79 42.27,64.87 42.27,56.79 45.72,53.34 53.34,53.34 54.61,52.07 U5.4 | 100A_REF:U1.5 45.09,69.22 v44.45,68.58
  Bottom 0.254: v44.45,67.06 v44.45,68.58
100A_SENSE
  Top 0.254: U2.3 49.96,67.74 50.8,68.58 | R1.1 44.87,86.36 CURRENT1.P$2 47.01,85.09 49.53,85.09 50.8,83.82 50.8,68.58 | 100A_SENSE:U1.2 47.62,64.14 50.8,67.31 50.8,68.58
100A_SENSE:CLK
  Top 0.254: 100A_SENSE:U1.8 48.9,56.73 100A_SENSE:C1.1
100A_SENSE:COM
  Top 0.254: 100A_SENSE:U1.6 46.35,59.56 45.81,60.11 | 45.81,60.11 100A_SENSE:C3.1 | 45.81,60.11 46.74,60.11 48.9,62.27 100A_SENSE:U1.1
100A_SENSE_FILT
  Top 0.254: 100A_SENSE:U1.5 45.09,55.24 45.72,54.61 53.34,54.61 55.88,52.07 U5.3
300A_REF
  Top 0.254: 300A_REF:U1.2 61.59,78.74 61.59,79.38 61.59,83.25 CURRENT2.P$3
300A_REF:CLK
  Top 0.254: 300A_REF:U1.8 62.87,69.43 300A_REF:C1.1
300A_REF:COM
  Top 0.254: 300A_REF:U1.6 60.33,72.14 59.65,72.81 | 300A_REF:C3.1 59.65,72.81 | 300A_REF:U1.1 62.87,75.06 60.62,72.81 59.65,72.81
300A_REF_FILT
  Top 0.254: 300A_REF:U1.5 59.05,67.31 55.88,64.14 55.88,54.61 57.15,53.34 U5.2
300A_SENSE
  Top 0.254: CURRENT2.P$2 59.71,86.34 | 59.71,86.34 60.96,85.09 63.5,85.09 64.12,84.47 64.12,66.66 61.59,64.14 300A_SENSE:U1.2 | R2.1 58.82,86.34 59.71,86.34
300A_SENSE:CLK
  Top 0.254: 300A_SENSE:U1.8 62.87,56.73 300A_SENSE:C1.1
300A_SENSE:COM
  Top 0.254: 300A_SENSE:U1.6 60.33,59.56 59.78,60.11 | 59.78,60.11 300A_SENSE:C3.1 | 300A_SENSE:U1.1 62.87,62.36 60.62,60.11 59.78,60.11
300A_SENSE_FILT
  Top 0.254: 300A_SENSE:U1.5 59.05,56.52 58.42,55.88 58.42,54.61 58.42,50.8 U5.1
+3V3  (via drill 0.38)
  Top 0.254: U7.5 62.89,40.01 U6.5 59.08,37.47 52.25,37.47 | 52.25,37.47 51.55,36.77 51.55,36.29 U9.1 51.38,36.24 v36.83,50.8 38.1,52.07 U$7.P$1 | U9.8 55.28,40.5 | 55.28,40.5 52.25,37.47 | 27.94,56.77 25.27,56.77 25.01,57.04 U4.6 | R11.1 R13.1 28.79,57.62 27.94,56.77 | 27.94,56.77 30.86,56.77 v31.75,55.88 | 55.28,40.5 55.27,40.51 v54.48,40.51
  Top 0.508: U9.1 51.38,34.66 C10.1 51.02,31.59 42.55,23.13 16.24,23.13 TEENSY3.1.3.3V
  Bottom 0.254: v36.83,50.8 v31.75,55.88 | v54.48,40.51 53.34,39.37 R36.1
+5V  (via drill 0.38, 0.76)
  Top 0.254: 100A_REF:U1.4 45.09,77.89 100A_REF:C2.1 v43.69,78.11 | 100A_SENSE:U1.4 45.09,65.19 100A_SENSE:C2.1 43.9,64.43 v43.9,64.14 | U$4.P$1 v31.88,59.69 | 300A_REF:U1.4 59.05,77.89 300A_REF:C2.1 v57.66,78.11 | 100A_REF:U1.7 v47.62,72.77 | 100A_SENSE:U1.7 v47.62,60.07 | 300A_REF:U1.7 v61.59,72.77 | 300A_SENSE:U1.4 59.05,65.19 300A_SENSE:C2.1 58.45,65.01 v57.67,65.01 | 300A_SENSE:U1.7 v61.59,60.07 | C5.1 58.42,42.97 U5.14 | C5.1 57.15,43.4 U5.13 | C5.1 C7.1 58.29,39.71 v58.29,38.88 | U10.3 17.14,14.82 C11.2 C12.2 17.69,11.73 v18.59,11.73 | U4.7 U4.8 v26.79,57.54 v26.8,57.53 | U9.14 50.76,41.65 C6.1 50.38,42.38 v50.42,42.42 | U4.9 26.01,62.58 v26.25,62.83 | U4.12 24.51,60.67 v24.56,60.62 | ON-LED.A 37.97,48.48 v37.4,48.48 | v22.5,56.39 22.5,57.53 U4.1
  Bottom 0.508: U15.4 v65.53,76.2
  Bottom 1.016: U3.3 13.76,57.15 C13.1
  pour Route2 (rank 2): 12.06,87.63 12.06,64.77 40.64,64.77 40.64,87.63
  pour Route15 (no thermals): 7.62,87.63 7.62,7.62 132.72,7.62 132.72,87.63
+12V  (via drill 0.38)
  Top 0.254: U2.5 41.27,70.46 C2.2 41.24,70.87 v41.24,64.77 39.37,64.77 36.83,62.23 36.83,58.42 U$5.P$1
  Top 2.032: BOARDFUSE.R2 BOARDFUSE.R1
  Bottom 0.254: v41.24,64.77 39.37,64.77 38.86,64.26 13.46,64.26 U3.1
  Bottom 0.508: BOARDFUSE.R1 7.62,26.19 7.62,8.89 8.89,7.62 47.99,7.62 | 47.99,7.62 54.1,7.62 56.52,7.62 | SOFTWARE_SHUTDOWN.2 59.08,7.62 56.52,7.62 | U11.4 41.51,37.7 | 41.51,37.7 45.72,33.48 45.72,30.48 54.1,22.1 54.1,14.61 54.1,10.03 56.52,7.62 | U12.4 35.16,37.7 41.51,37.7 | D3.C 47.99,7.62
  Bottom 1.016: 8.09,50.89 10.05,50.89 ENERGYMETER.P$1 | 8.09,50.89 7.46,50.26 7.46,48.26 10,45.72 | BOARDFUSE.R2 15.24,37.21 15.24,43.18 12.7,45.72 10,45.72 | 8.09,50.89 8.09,58.89 U3.1 13.76,62.23 C14.1 | IMD.P$1 10.16,45.56 10,45.72
  Bottom 2.032: BOARDFUSE.R1 BOARDFUSE.R2
+12VIN
  Top 2.032: BOARDFUSE.L1 BOARDFUSE.L2 22.1,34.16 22.1,46.23 22.77,46.9 MAIN.P$4
  Bottom 1.016: D5.P$2 20.27,29.21 20.32,29.26 BOARDFUSE.L1
  Bottom 2.032: BOARDFUSE.L2 BOARDFUSE.L1
BMS_OK  (via drill 0.76)
  Top 0.254: MAIN.P$7 26.92,52.07 R16.1 | U$14.P$1 37.68,34.51 C9.2
  Top 0.508: C9.2 R24.2 37.93,39.62 37.93,42.33 37.08,43.18 35.05,43.18 v34.67,42.8
  Bottom 0.508: MAIN.P$7 26.76,51.88 34.67,43.96 v34.67,42.8
BMS_OK_3.3V  (via drill 0.38)
  Top 0.254: v62.23,39.37 R26.2 | v41.91,35.56 44.45,38.1 v48.26,38.1 | v34.29,33.02 36.08,31.23 BMS-OK.A | U7.4 v64.77,42.14 v64.76,42.15 64.14,42.78 U$10.P$1
  Bottom 0.254: v64.76,42.15 62.23,39.62 v62.23,39.37 60.96,40.64 56.52,40.64 53.98,38.1 v48.26,38.1 | v41.91,35.56 39.25,32.9 37.02,32.9 36.27,33.66 R34.1 35.34,33.02 v34.29,33.02
BMS_OK_PRE_FILTER  (via drill 0.76)
  Top 0.508: R24.1 36.83,40.22 v36.83,41.91
  Bottom 0.508: v36.83,41.91 36.02,41.1 U11.3
BMS_STATUS  (via drill 0.38)
  Top 0.254: U7.1 63.48,37.7 R27.2 63.5,35.14 63.5,33.02 60.96,30.48 57.15,30.48 49.53,22.86 v49.53,15.24
  Bottom 0.254: 43.35,12.8 47.09,12.8 v49.53,15.24 | D4.3 44.18,11.43 R33.1 | R32.2 D4.3 | 43.35,12.8 D4.3 | TEENSY3.1.D5 28.04,12.8 43.35,12.8
BSPD_CURR:INPUT_POST_DIODE
  Top 0.254: BSPD_CURR:R1.1 23.5,15.51 BSPD_CURR:D1.C
BSPD_CURR_TEENSY  (via drill 0.38)
  Top 0.254: BSPD_CURR:R2.1 BSPD_CURR:R1.2 23.5,20.95 v22.23,22.23
  Bottom 0.254: TEENSY3.1.A7 v22.23,22.23
BSPD_CURRENT  (via drill 0.38)
  Top 0.254: MAIN.P$3 25.6,50.75 34.24,50.75 36.83,53.34 36.83,56.52 38.1,57.78 38.95,57.78 | v20.64,47.31 20.32,46.99 v20.32,45.72 | v25.78,18.41 25.78,14.35 25.4,13.97 23.23,13.97 BSPD_CURR:D1.A | 38.95,57.78 R15.2 41.27,59.05 41.88,59.66 U2.1 | U$6.P$1 39.37,57.37 38.95,57.78
  Bottom 0.254: MAIN.P$3 22.73,49.4 v20.64,47.31 | v20.32,45.72 20.32,41.91 19.05,40.64 19.05,39.37 25.78,32.64 v25.78,18.41
CANH
  Top 0.254: U10.7 15.88,20.95 15.22,20.3 11.74,20.3 10.83,21.21 10.83,25.37 12.13,26.67 21.59,26.67 26.35,31.43 U8.2 26.35,44 MAIN.P$10 26.8,44.45 R21.2
  Bottom 0.254: ENERGYMETER.P$4 18.75,48.28 21.28,45.75 25.37,45.75 26.72,44.4 MAIN.P$10
CANL
  Top 0.254: MAIN.P$9 25.41,45.56 25.41,43.92 25.4,43.91 25.4,43.18 24.45,42.23 U8.1 24.45,30.07 21.43,27.05 11.97,27.05 10.41,25.5 10.41,21.05 11.55,19.91 16.11,19.91 17.14,20.95 U10.6 | MAIN.P$9 26.14,46.9 24.86,48.18 18.92,48.18 16.33,50.78 ENERGYMETER.P$3 | R19.2 27.3,46.35 MAIN.P$9
CANRX
  Top 0.254: U10.4 18.41,13.97 22.23,10.16 TEENSY3.1.D4(CANRX)
CANTX
  Top 0.254: TEENSY3.1.D3(CANTX) 18.83,8.67 16.79,8.67 14.61,10.86 U10.1
CHARGE_ENABLE
  Top 0.254: CHARGE_ENABLE:D1.A 109.96,12.44 D2.C
  Top 0.508: MAIN.P$2 22.82,53.34 8.89,53.34 7.62,52.07 7.62,8.89 8.89,7.62 103.14,7.62 D2.C
CHARGE_ENABLE:INPUT_POST_DIODE
  Top 0.254: CHARGE_ENABLE:R1.1 112.03,12.7 CHARGE_ENABLE:D1.C
CHARGE_ENABLE_TEENSY  (via drill 0.38)
  Top 0.254: CHARGE_ENABLE:R2.1 CHARGE_ENABLE:R1.2 113.88,8.89 v106.68,8.89 | v50.8,17.78 62.72,17.78 66.04,14.46 66.04,11.43 68.58,8.89 v102.87,8.89
  Bottom 0.254: TEENSY3.1.A4 36.83,17.78 v50.8,17.78 | v106.68,8.89 v102.87,8.89
CS_ADC_5V
  Top 0.254: U5.8 50.8,43.18 51.44,42.55 51.82,42.55 52.03,42.33 U9.13
CS_ADC_TEENSY
  Top 0.254: U9.2 52.03,31.66 34.92,14.55 TEENSY3.1.D9(RX2)
CS_LTC6820  (via drill 0.38)
  Top 0.254: TEENSY3.1.D10(TX2) 37.47,14.61 v36.83,15.24 | U4.5 24.51,57.99 25.07,58.55 v25.26,58.55
  Bottom 0.254: v25.26,58.55 25.41,58.41 25.41,49.12 26.47,48.06 27.36,48.06 27.94,47.48 27.94,39.37 26.67,38.1 26.67,36.83 27.75,35.75 27.75,30.5 28.57,29.68 28.57,23.5 v36.83,15.24
DISCHARGE+
  Top 2.032: DISCHARGE+.P$2 130.3,57.26 130.18,57.26 130.18,55.72 130.63,55.27 DISCHARGE+.P$1 130.81,46.16 $$U$12.CONTACT2
  Bottom 2.032: DISCHARGE+.P$2 130.32,57.28 130.18,57.28 130.18,55.72 130.63,55.27 DISCHARGE+.P$1 130.81,46.16 $$U$12.CONTACT2
GND  (via drill 0.38, 0.64, 0.76, 1.02)
  Top 0.254: 100A_REF:C1.2 v46.23,69.22 | 100A_REF:U1.3 46.35,77.89 100A_REF:C2.2 46.23,78.45 v46.23,80.26 | 100A_REF:C3.2 v43.81,75.69 | 100A_SENSE:C3.2 v43.81,62.99 | 100A_SENSE:U1.3 46.35,65.19 100A_SENSE:C2.2 v47.75,65.41 | U2.2 v42.55,66.17 | 100A_SENSE:C1.2 v46.23,56.52 | U$3.P$1 v32,63.5 | 300A_REF:U1.3 60.33,77.89 300A_REF:C2.2 60.2,78.45 v60.2,80.26 | 300A_REF:C1.2 v60.2,69.22 | 300A_SENSE:U1.3 60.33,65.19 300A_SENSE:C2.2 v61.72,65.41 | 300A_SENSE:C3.2 v57.78,62.99 | 300A_REF:C3.2 v57.78,75.69 | U5.12 55.88,42.97 C5.2 C7.2 56.3,39.82 55.99,39.51 v55.99,38.88 | v59.18,42.16 61.27,42.16 61.59,42.49 U6.2 | U6.3 60.88,42.67 v60.2,42.67 | v65.53,37.85 64.82,37.85 U7.3 | R27.1 v64.77,33.53 | R26.1 v62.23,33.53 | U10.2 15.88,14.82 C11.1 C12.1 17.11,10.61 v18.35,10.61 | U9.7 55.3,36.1 v55.3,34.98 | R14.2 21.17,56.43 v21.21,56.39 | R25.2 v59.69,33.53 | U4.14 23.51,60.59 v23.42,60.5 | R31.2 v47.62,14.35 | v19.05,43.31 19,43.26 R22.2 | R16.2 v34.29,52.07 | R18.2 v36.83,49.53 | C6.2 v47.5,41.27 | R29.2 35.31,28.54 v35.31,28.07 | R28.2 29.34,28.92 v29.34,28.07 | 300A_SENSE:C1.2 v60.2,56.52 | C2.1 v41.27,73.79 | R2.2 v57.15,81.79 | R1.2 v43.18,81.79 | C3.2 v10.16,68.45 | R20.2 41.4,45.09 v41.41,45.1 | U4.13 24.01,62.35 23.61,62.76 v22.86,62.76 | U5.7 v50.8,52.32 | R30.1 12.06,22.86 v13.34,24.13 | U8.3 v25.4,42.16 | R17.1 v60.96,52.2 | BSPD_CURR:R2.2 v21.59,17.02 | CHARGE_ENABLE:R2.2 v114.81,14.61 | IMD_OK:R2.2 27.94,17.65 v27.3,17.02 | SHUTDOWN_H:R2.2 v70.36,14.61 | SHUTDOWN_I:R2.2 v80.52,14.61 | SHUTDOWN_J:R2.2 v90.68,14.61 | C4.1 35.52,44.07 v35.56,44.07 | SHUTDOWN_K:R2.2 v100.84,14.61 | R10.2 39.37,61.81 v39.37,63.63
  Top 0.508: v49.28,36.7 49.31,36.66 C10.2 | C9.1 34.29,35.77 v34.29,35.56 | C8.1 v27.69,37.47
  Top 1.016: D1.A v97.28,31.75
  Route2 6.096: $$U$12.COIL+ 102.08,45.64 86.64,30.2
  Bottom 0.254: D4.1 43.31,13.7 v43.31,14.73 | R33.2 38.85,11.43 v38.72,11.56 | U12.2 29.34,35.23 v30.23,35.23 | v36.58,35.23 35.69,35.23 U11.2 | 60V-THRESHOLD:R2.2 v54.61,61.72 | R36.2 50.84,38.99 v49.66,38.99
  Bottom 0.508: Q1.2 45.99,11.22 v46.62,11.85
  Bottom 1.016: U3.2 12.91,59.69 | 12.91,59.69 C13.2 | 12.91,59.69 C14.2 | D5.P$1 15.24,29.21 v14.61,28.57
  other vias: 12.45,3.94 17.53,3.94 22.61,3.94 27.69,3.94 32.77,3.94 37.85,3.94 42.93,3.94 48.01,3.94 53.09,3.94 58.17,3.94 63.25,3.94 68.33,3.94 73.41,3.94 78.49,3.94 3.94,13.72 3.94,18.8 3.94,23.88 3.94,28.96 3.94,34.04 3.94,39.12 3.94,44.2 3.94,49.28 3.94,54.36 3.94,59.44 3.94,64.52 3.94,69.6 3.94,74.68 3.94,79.76
  pour Top (no thermals): 6.86,87.63 6.86,1.02 1.02,1.02 1.02,87.63
  pour Bottom (no thermals): 6.86,87.63 6.86,1.02 1.02,1.02 1.02,87.63
  pour Top (no thermals): 7.37,6.86 7.37,1.02 86.11,1.02 86.11,6.86
  pour Bottom (no thermals): 7.37,6.86 7.37,1.02 138.98,1.02 138.98,6.86
  pour Route2 (no thermals): 1.02,1.02 132.72,1.02 132.72,87.63 1.02,87.63
HV+FUSED  (via drill 1.02)
  Top 1.016: v106.68,70.87 v106.68,74.3 106.68,74.93 113.88,82.13 R3.2 117.26,82.13 118.15,81.24 118.15,78.05 HV+FUSED.P$2
  Top 2.032: 126.36,75.56 129.54,75.56 129.54,75.55 IMD+.P$2 | 126.36,75.56 123.19,75.56 123.19,75.55 HV+FUSED.P$2 | 126.36,70.48 123.19,70.48 123.19,70.5 HV+FUSED.P$1 | 126.36,70.48 129.54,70.48 129.54,70.5 IMD+.P$1 | 126.36,70.48 126.36,75.56
  Bottom 1.016: U16.1 108.36,78.27 108.35,78.27 108.35,76.6 106.68,74.93 v106.68,74.3 | U13.1 108.24,69.3 v106.68,70.87
  Bottom 2.032: 126.36,70.48 129.54,70.48 129.54,70.5 IMD+.P$1 | 126.36,70.48 123.19,70.48 123.19,70.5 HV+FUSED.P$1 | 126.36,75.56 123.19,75.56 121.92,74.3 HV+FUSED.P$2 | 126.36,75.56 129.54,75.56 129.54,75.55 IMD+.P$2 | 126.36,75.56 126.36,70.48
HV+UNFUSED
  Top 2.032: C1.P$1 84.45,64.11 HV+UNFUSED.P$2 78.08,57.77 77.47,57.15 77.47,55.88 78.08,55.27 HV+UNFUSED.P$1 78.11,44.25 $$U$12.CONTACT1
  Bottom 2.032: C1.P$1 84.45,64.11 HV+UNFUSED.P$2 78.08,57.77 77.47,57.15 77.47,55.88 78.08,55.27 HV+UNFUSED.P$1 78.11,44.25 $$U$12.CONTACT1
HV-FUSED
  Top 1.016: R9.1 117.24,63.52 HV-FUSED.P$1 119.36,60.96 94.59,60.96 INDICATOR.P$2
  Top 2.032: 126.36,67.31 123.19,67.31 121.92,66.04 HV-FUSED.P$2 | 126.36,67.31 129.54,67.31 129.54,67.29 IMD-.P$2 | 126.36,62.23 129.54,62.23 130.81,63.5 IMD-.P$1 | 126.36,62.23 123.19,62.23 123.19,62.25 HV-FUSED.P$1 | 126.36,62.23 126.36,67.31
  Bottom 0.508: HV-FUSED.P$1
  Bottom 1.016: Q2.3 121.67,63.27 HV-FUSED.P$1 | HV-FUSED.P$2 115.55,72.39 | R38.2 115.55,72.39 | 115.55,72.39 115.55,72.41 112.61,75.35 R41.2
  Bottom 2.032: 126.36,67.31 123.19,67.31 121.92,66.04 HV-FUSED.P$2 | 126.36,67.31 129.54,67.31 129.54,67.29 IMD-.P$2 | 126.36,62.23 129.54,62.23 130.81,63.5 IMD-.P$1 | 126.36,62.23 123.19,62.23 123.19,62.25 HV-FUSED.P$1 | 126.36,67.31 126.36,62.23
HV-UNFUSED
  Top 2.032: 126.36,80.01 123.19,80.01 121.92,81.28 HV-UNFUSED.P$1 | 126.36,80.01 129.54,80.01 129.54,80.03 DISCHARGE-.P$1 | 123.19,85.09 126.36,85.09 | 126.36,85.09 129.54,85.09 129.54,85.07 DISCHARGE-.P$2 | HV-UNFUSED.P$2 121.92,83.82 123.19,85.09 | C1.P$2 90.89,86.36 121.92,86.36 123.19,85.09 | 126.36,85.09 126.36,80.01
  Bottom 2.032: 126.36,80.01 129.54,80.01 129.54,80.03 DISCHARGE-.P$1 | 126.36,80.01 123.19,80.01 123.19,80.03 HV-UNFUSED.P$1 | DISCHARGE-.P$2 129.54,85.07 129.54,85.09 126.36,85.09 | 126.36,85.09 123.19,85.09 123.19,85.07 | HV-UNFUSED.P$2 123.19,85.07 | C1.P$2 90.89,86.36 121.9,86.36 123.19,85.07 | 126.36,85.09 126.36,80.01
IM
  Top 0.254: U1.P$10 11.68,75.86 11.68,64.52 12.06,64.14 24.77,64.14 25.51,63.39 U4.10
IMD_OK  (via drill 0.38, 0.76)
  Top 0.254: MAIN.P$8 26.88,49.53 R18.1 | v23.5,25.4 23.5,26.04 24.51,27.05 32.13,27.05 33.02,27.94 33.02,35.77 C8.2 | IMD_OK:D1.A 28.31,14.34 v27.94,13.97 | U$13.P$1 31.33,34.51 31.33,38.1
  Top 0.508: C8.2 31.33,38.1 R23.2 33.02,41.06 v33.02,41.91
  Bottom 0.254: v27.94,13.97 23.5,18.41 v23.5,25.4
  Bottom 0.508: MAIN.P$8 26.8,49.4 33.02,43.18 v33.02,41.91
IMD_OK:INPUT_POST_DIODE
  Top 0.254: IMD_OK:D1.C 29.84,16.77 IMD_OK:R1.1
IMD_OK_12V  (via drill 0.38)
  Top 0.254: IMD.P$5 18.73,40.64 R22.1 | R22.1 19,40.17 18.78,40.39 v20.56,40.39 | v27,34.29 27,32.17 v28.69,30.48 IMD-OK.A | R22.1 19.05,40.32 U$11.P$1
  Bottom 0.254: R35.1 28.69,32.71 v28.69,30.48 | v27,34.29 20.9,40.39 v20.56,40.39
IMD_OK_PRE_FILTER  (via drill 0.76)
  Top 0.508: R23.1 30.48,40.22 v30.48,41.91
  Bottom 0.508: U12.3 29.67,41.1 v30.48,41.91
IMD_OK_TEENSY  (via drill 0.38)
  Top 0.254: IMD_OK:R1.2 IMD_OK:R2.1 v27.94,21.59
  Bottom 0.254: v27.94,21.59 27.3,22.23 TEENSY3.1.A5
IP
  Top 0.254: U1.P$12 8.61,66.32 11.43,63.5 24.13,63.5 25.01,62.62 U4.11
ISOSPI-M
  Top 0.508: U1.P$3 24.89,78.93 25.72,78.11 R4.2 27.73,82.15 ISOSPI.P$2
ISOSPI-P
  Top 0.508: ISOSPI.P$1 29.43,82.15 R4.1 29.43,76.42 27.94,74.93 U1.P$1
MISO_5V
  Top 0.254: U9.11 U5.10
MISO_TEENSY  (via drill 0.38)
  Top 0.254: U9.4 53.34,30.48 v52.07,29.21 42.55,19.68 TEENSY3.1.D12 | R13.2 26.71,59.44 24.06,59.44 23.47,58.85 23.47,57.57 U4.3 23.47,57.51 23.47,57.12 24.2,56.38 28.07,56.38 29.39,55.06 v29.39,53.27
  Bottom 0.254: v52.07,29.21 48.19,33.09 48.19,34.48 v29.39,53.27
MOSI_5V
  Top 0.254: U9.12 52.68,42.31 52.07,42.93 U5.9
MOSI_TEENSY  (via drill 0.38)
  Top 0.254: TEENSY3.1.D11 40.01,18.36 v52.68,31.04 U9.3 | R11.2 27,60.96 26.02,59.97 24.03,59.97 23.01,58.95 U4.2 23.01,56.96 24.34,55.62 v27.68,55.62
  Bottom 0.254: v52.68,31.04 51.38,31.04 48.83,33.59 48.83,34.86 28.06,55.62 v27.68,55.62
N$1
  Bottom 0.508: SOFTWARE_SHUTDOWN.1 52.43,10.16 51.16,10.16 | 51.16,10.16 51.16,8.98 D3.A | Q1.3 48.62,10.16 51.16,10.16
N$2
  cutout Route15 (rank 2): 12.06,64.77 40.64,64.77 40.64,87.63 12.06,87.63
N$3
  Top 0.254: R20.1 38.52,46.28 ON-LED.C
N$4
  Bottom 1.016: Q2.1 116.42,59.69 R37.2
N$5
  Bottom 1.016: U14.4 95.71,72.39 R39.2 107.73,71.97 108.46,71.25 109.47,71.25 109.86,70.87 U13.2 U13.PAD
N$6
  Bottom 1.016: R39.1 R38.1 111.36,71.94 U13.3
N$7  (via drill 0.38)
  Top 0.254: R15.1 R10.1 39.27,60.21 40.88,60.21 41.27,60.61 41.27,62.48 v40.64,63.12 | U2.4 43.18,70.09 v44.21,71.12
  Bottom 0.254: v40.64,63.12 40.68,63.12 41.9,64.33 41.9,67.3 44.21,69.61 v44.21,71.12
N$8
  Bottom 0.254: U12.1 31.75,34.08 R35.2
N$9
  Top 0.254: R28.1 31.33,30.38 IMD-OK.C
N$11
  Top 0.254: R19.1 R21.1 33.44,44.45 C4.2
N$12
  Bottom 0.254: R32.1 44.55,8.57 Q1.1
N$13
  cutout Route2 (rank 2): 12.06,87.63 40.64,87.63 40.64,64.77 12.06,64.77
N$14
  cutout Route2: 66.04,87.63 66.04,32.38 132.72,32.38 132.72,87.63
  cutout Route15: 66.04,87.63 66.04,32.38 132.72,32.38 132.72,87.63
N$16
  Bottom 0.254: U11.1 38.1,34.08 R34.2
N$17
  Top 0.254: R29.1 37.68,30.38 BMS-OK.C
N$18
  Bottom 1.016: U15.1 75.39,74.93 101.51,74.93 106.69,80.11 | U16.PAD U16.2 109.86,79.38 109.12,80.11 106.69,80.11 | 106.69,80.11 107.73,81.16 R42.2
N$19
  Top 1.016: R5.1 R3.1
N$24
  Top 1.016: R6.2 R5.2
N$26
  Top 0.254: R30.2 14.61,21.8 U10.8
N$27
  Top 1.016: R8.1 R7.1
N$28
  Top 1.016: R9.2 R8.2
N$29
  Top 0.254: TEENSY.C 46.45,17.36 R31.1
N$30
  Bottom 1.016: U14.2 90.59,78.35 R40.1
N$31
  Top 0.254: R12.1 21.17,60.4 U4.16
N$32
  Top 0.254: R12.2 R14.1 20.62,59.57 21.82,59.57 22.38,60.13 22.38,60.5 23.01,61.12 U4.15
N$33
  Bottom 1.016: U15.2 U14.1
N$34  (via drill 1.02)
  Top 1.016: v95.89,77.22 95.89,64.75 INDICATOR.P$1
  Bottom 1.016: v95.89,77.22 95.58,77.22 94.57,76.2 U14.3
N$35
  Top 0.254: U1.P$11 8.61,76.92 9.96,75.57 10.16,75.36 C3.1
N$41
  Bottom 1.016: R42.1 R41.1 111.36,81.47 U16.3
N$55  (via drill 1.02)
  Top 1.016: R6.1 R7.2 115.99,72.39 115.57,72.39 113.03,69.85 v113.03,63.5
  Bottom 1.016: R37.1 113.03,61.38 v113.03,63.5
N$58  (via drill 1.02)
  Top 1.016: v107.19,64.26 101.6,69.85 101.6,73.53 v97.92,77.22
  Bottom 1.016: v107.19,64.26 107.19,61.72 116.13,52.78 Q2.2(TAB) | v97.92,77.22 97.92,77.27 95.81,79.38 R40.2
SCK_5V
  Top 0.254: U9.10 53.98,42.3 54.61,42.93 U5.11
SCK_TEENSY  (via drill 0.38)
  Top 0.254: U9.5 53.98,35.55 54.1,35.43 v54.1,34.16 | U4.4 24.01,58.47 v24.12,58.58 | TEENSY3.1.D13 42.55,25.65 v50.16,33.27
  Bottom 0.254: v24.12,58.58 24.74,59.2 26.14,59.2 27.45,57.9 27.45,57.16 50.45,34.16 | v54.1,34.16 50.45,34.16 | 50.45,34.16 50.06,34.16 50.16,34.06 v50.16,33.27
SHUTDOWN_H  (via drill 0.38)
  Top 0.254: SHUTDOWN_H:D1.A 68.31,14.23 v66.04,16.51
  Bottom 0.254: 57.15,16.51 58.42,16.51 v66.04,16.51
  Bottom 1.016: SOFTWARE_SHUTDOWN.P 58.42,16.51 | 57.15,16.51 57.15,21.59 46.99,31.75 46.99,34.17 MAIN.P$6
SHUTDOWN_H:INPUT_POST_DIODE
  Top 0.254: SHUTDOWN_H:D1.C 68.84,12.7 SHUTDOWN_H:R1.1
SHUTDOWN_H_TEENSY  (via drill 0.38)
  Top 0.254: SHUTDOWN_H:R1.2 SHUTDOWN_H:R2.1 68.8,19.05 v50.8,19.05
  Bottom 0.254: TEENSY3.1.A3 38.1,19.05 v50.8,19.05
SHUTDOWN_I  (via drill 0.38)
  Top 0.254: v76.2,17.78 78.74,15.24 SHUTDOWN_I:D1.A
  Top 1.016: SOFTWARE_SHUTDOWN.S 64.67,25.4 INTERLOCK1.P$1
  Bottom 0.254: INTERLOCK1.P$1 72.41,21.57 v76.2,17.78
SHUTDOWN_I:INPUT_POST_DIODE
  Top 0.254: SHUTDOWN_I:D1.C 79,12.7 SHUTDOWN_I:R1.1
SHUTDOWN_I_TEENSY  (via drill 0.38)
  Top 0.254: SHUTDOWN_I:R1.2 SHUTDOWN_I:R2.1 77.69,20.32 v50.8,20.32
  Bottom 0.254: TEENSY3.1.A2 39.37,20.32 v50.8,20.32
SHUTDOWN_J  (via drill 0.38)
  Top 0.254: v86.36,17.78 88.9,15.24 SHUTDOWN_J:D1.A
  Top 1.016: INTERLOCK2.P$1 INTERLOCK1.P$2
  Bottom 0.254: INTERLOCK2.P$1 85.11,19.03 v86.36,17.78
SHUTDOWN_J:INPUT_POST_DIODE
  Top 0.254: SHUTDOWN_J:D1.C 89.17,12.7 SHUTDOWN_J:R1.1
SHUTDOWN_J_TEENSY  (via drill 0.38)
  Top 0.254: SHUTDOWN_J:R1.2 SHUTDOWN_J:R2.1 86.58,21.59 v50.8,21.59
  Bottom 0.254: TEENSY3.1.A1 40.64,21.59 v50.8,21.59
SHUTDOWN_K  (via drill 0.38)
  Top 0.254: v99.06,17.78 SHUTDOWN_K:D1.A
  Top 0.508: D2.A 99.33,22.86 97.79,22.86 95.25,25.4
  Top 1.016: INTERLOCK2.P$2 95.25,25.4 RELAY.P$1 102.08,29.67 102.08,31.75 | $$U$12.COIL- 102.08,31.75 | D1.C 102.08,31.75
  Bottom 0.254: RELAY.P$1 97.81,19.03 v99.06,17.78
SHUTDOWN_K:INPUT_POST_DIODE
  Top 0.254: SHUTDOWN_K:D1.C 99.33,12.7 SHUTDOWN_K:R1.1
SHUTDOWN_K_TEENSY  (via drill 0.38)
  Top 0.254: SHUTDOWN_K:R1.2 SHUTDOWN_K:R2.1 95.47,22.86 v50.8,22.86
  Bottom 0.254: TEENSY3.1.A0 41.91,22.86 v50.8,22.86
TEENSY_STATUS
  Top 0.254: TEENSY3.1.D6 28.19,10.41 32.83,10.41 34.57,8.67 42.9,8.67 44.45,10.22 44.45,12.06 46.35,13.97 TEENSY.A
WATCHDOG_INPUT  (via drill 0.38)
  Top 0.254: v60.33,37.72 59.69,37.08 R25.1 58,36.41 57.15,35.56 57.15,33.02 48.83,24.7 48.83,10.73 46.23,8.13 31.24,8.13 TEENSY3.1.D7(RX3) | U6.4 60.96,40.39 v60.33,39.75
  Bottom 0.254: v60.33,37.72 v60.33,39.75
WATCHDOG_OK
  Top 0.254: U7.2 64.14,40.62 62.26,42.49 U6.1 62.26,43.18 60.96,44.48 60.96,45.72 60.96,46.35 | U$9.P$1 60.96,46.35 | R17.2 60.96,46.35

### Text on the board
tDocu: TS | GLV | isoSPI | isoSPI | GLV | DANGER / HIGH VOLTAGE | isoSPI | GLV | GND | GLV | TS | DANGER / HIGH VOLTAGE | +5V | TS | +12V | BSPD | GLV | +3.3V | THRESHOLD | WATCHDOG | BMS STATUS | TS | TS | IMD STATUS | GLV | GLV | HyTech Racing 2020 / HV Board rev13 / Designed by Arvind Srinivasan, / based on rev10 by Yvonne Yeh
bDocu: GLV | isoSPI | isoSPI | GLV | DANGER / HIGH VOLTAGE | isoSPI | GLV | GLV | TS | DANGER / HIGH VOLTAGE | TS | GLV | TS | TS | GLV | GLV